# EAGLE board QuDAC (EAGLE 6.6.0), part 1 of 2
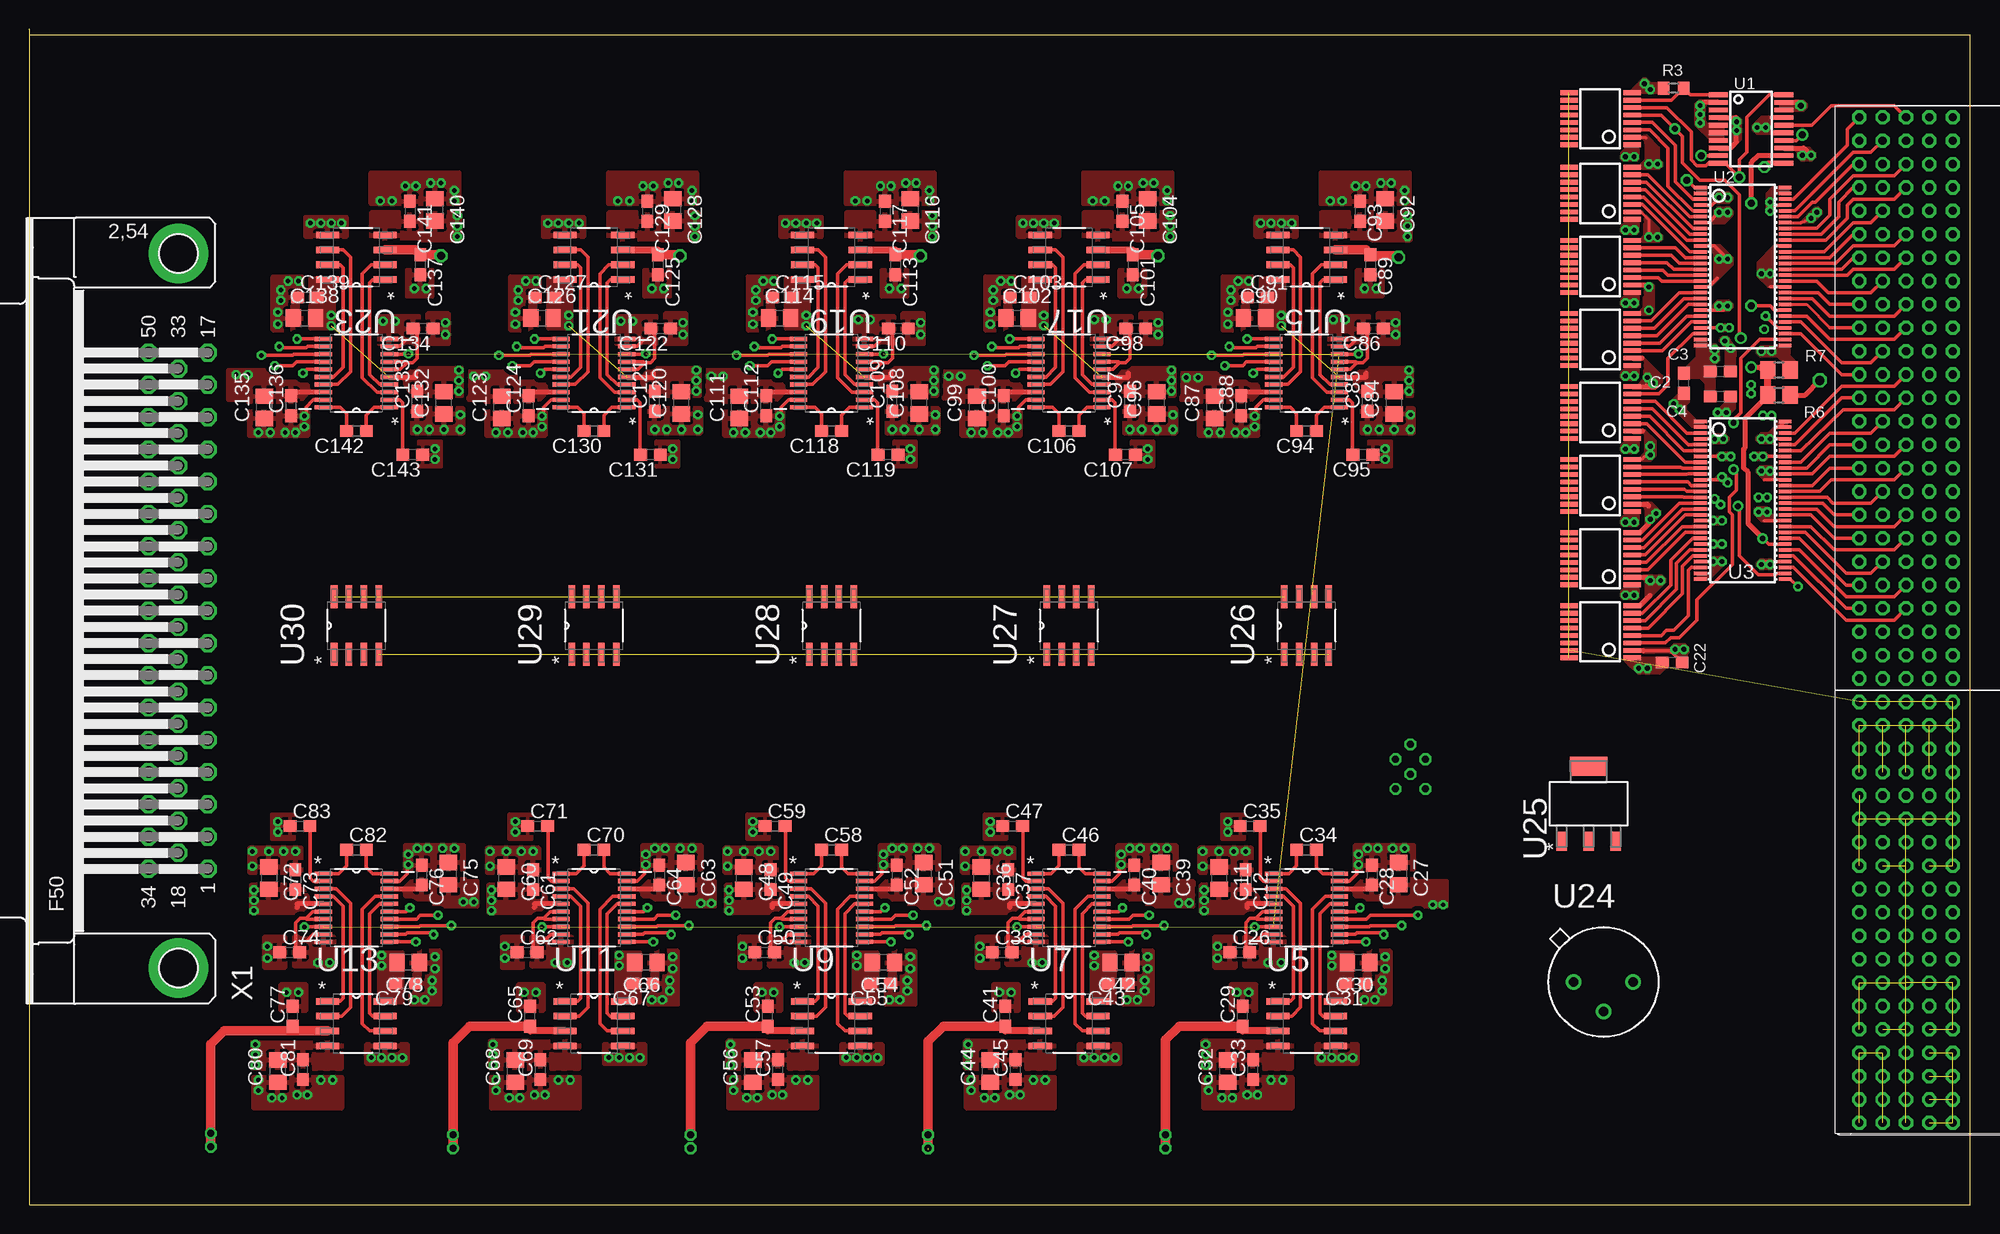
[diagram p14: board, top side]
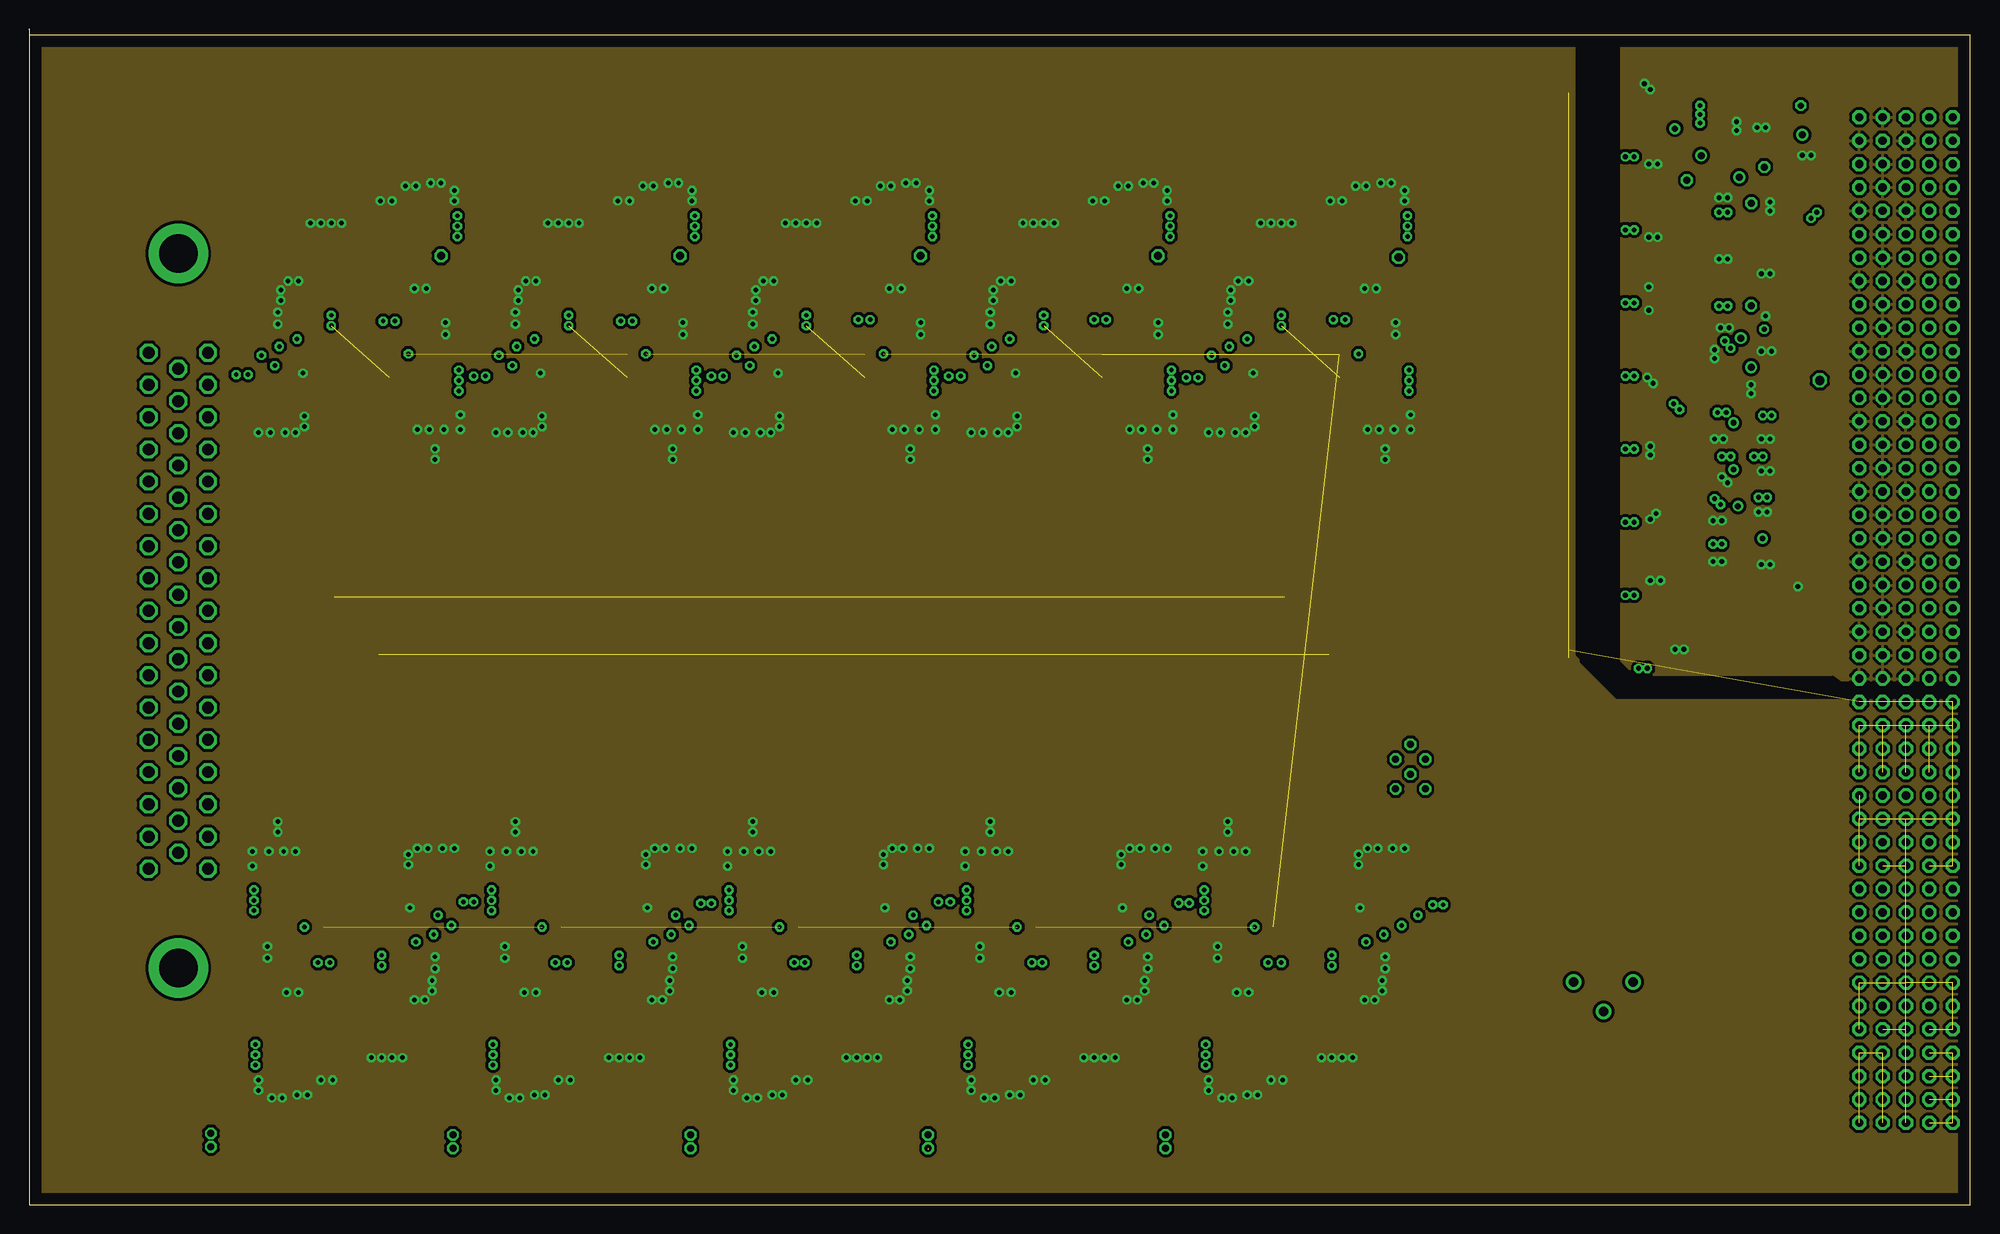
[diagram p15: board, inner layer Route2]
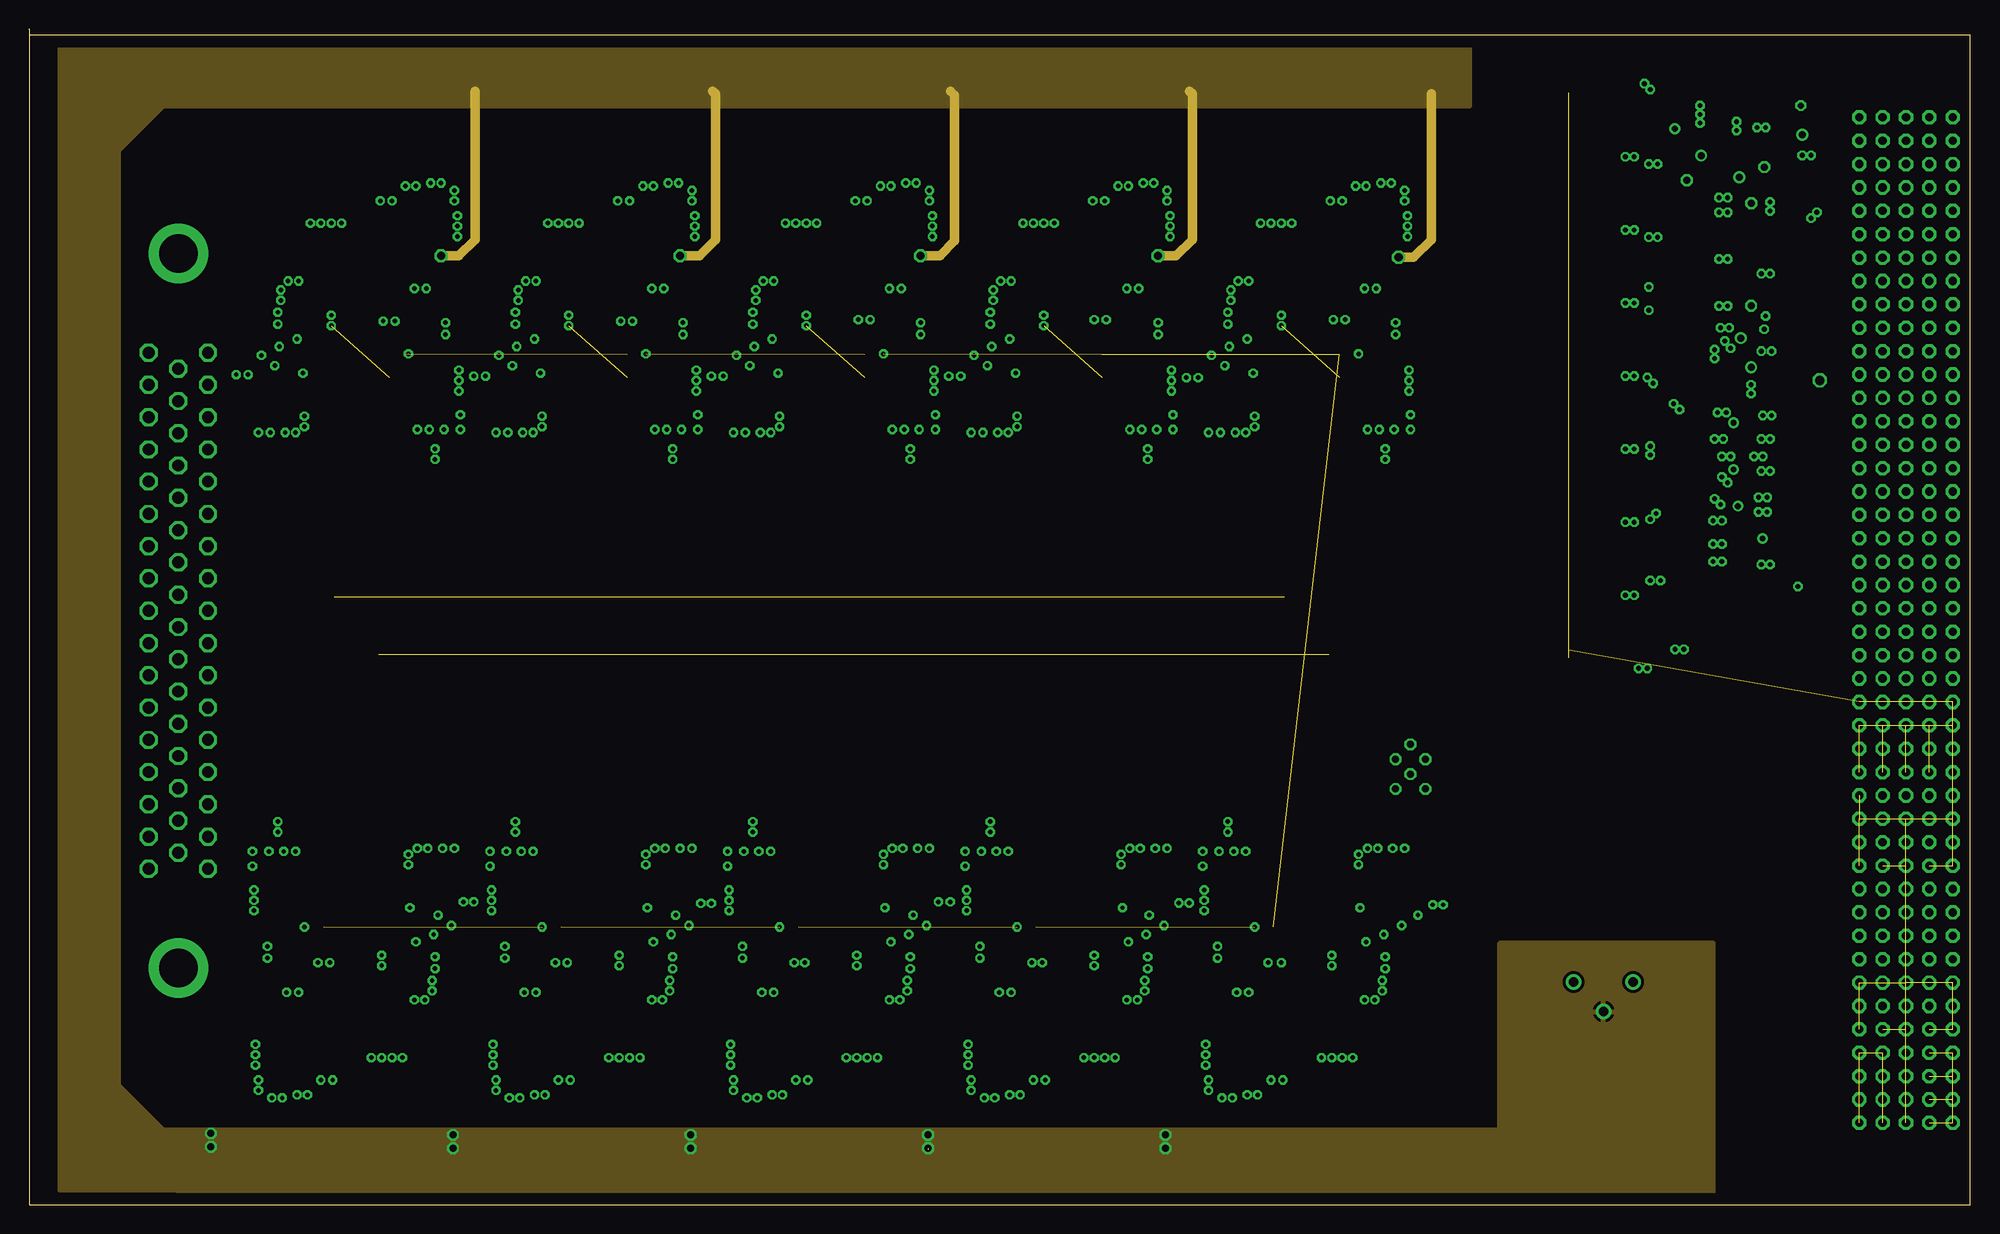
[diagram p16: board, inner layer Route3]
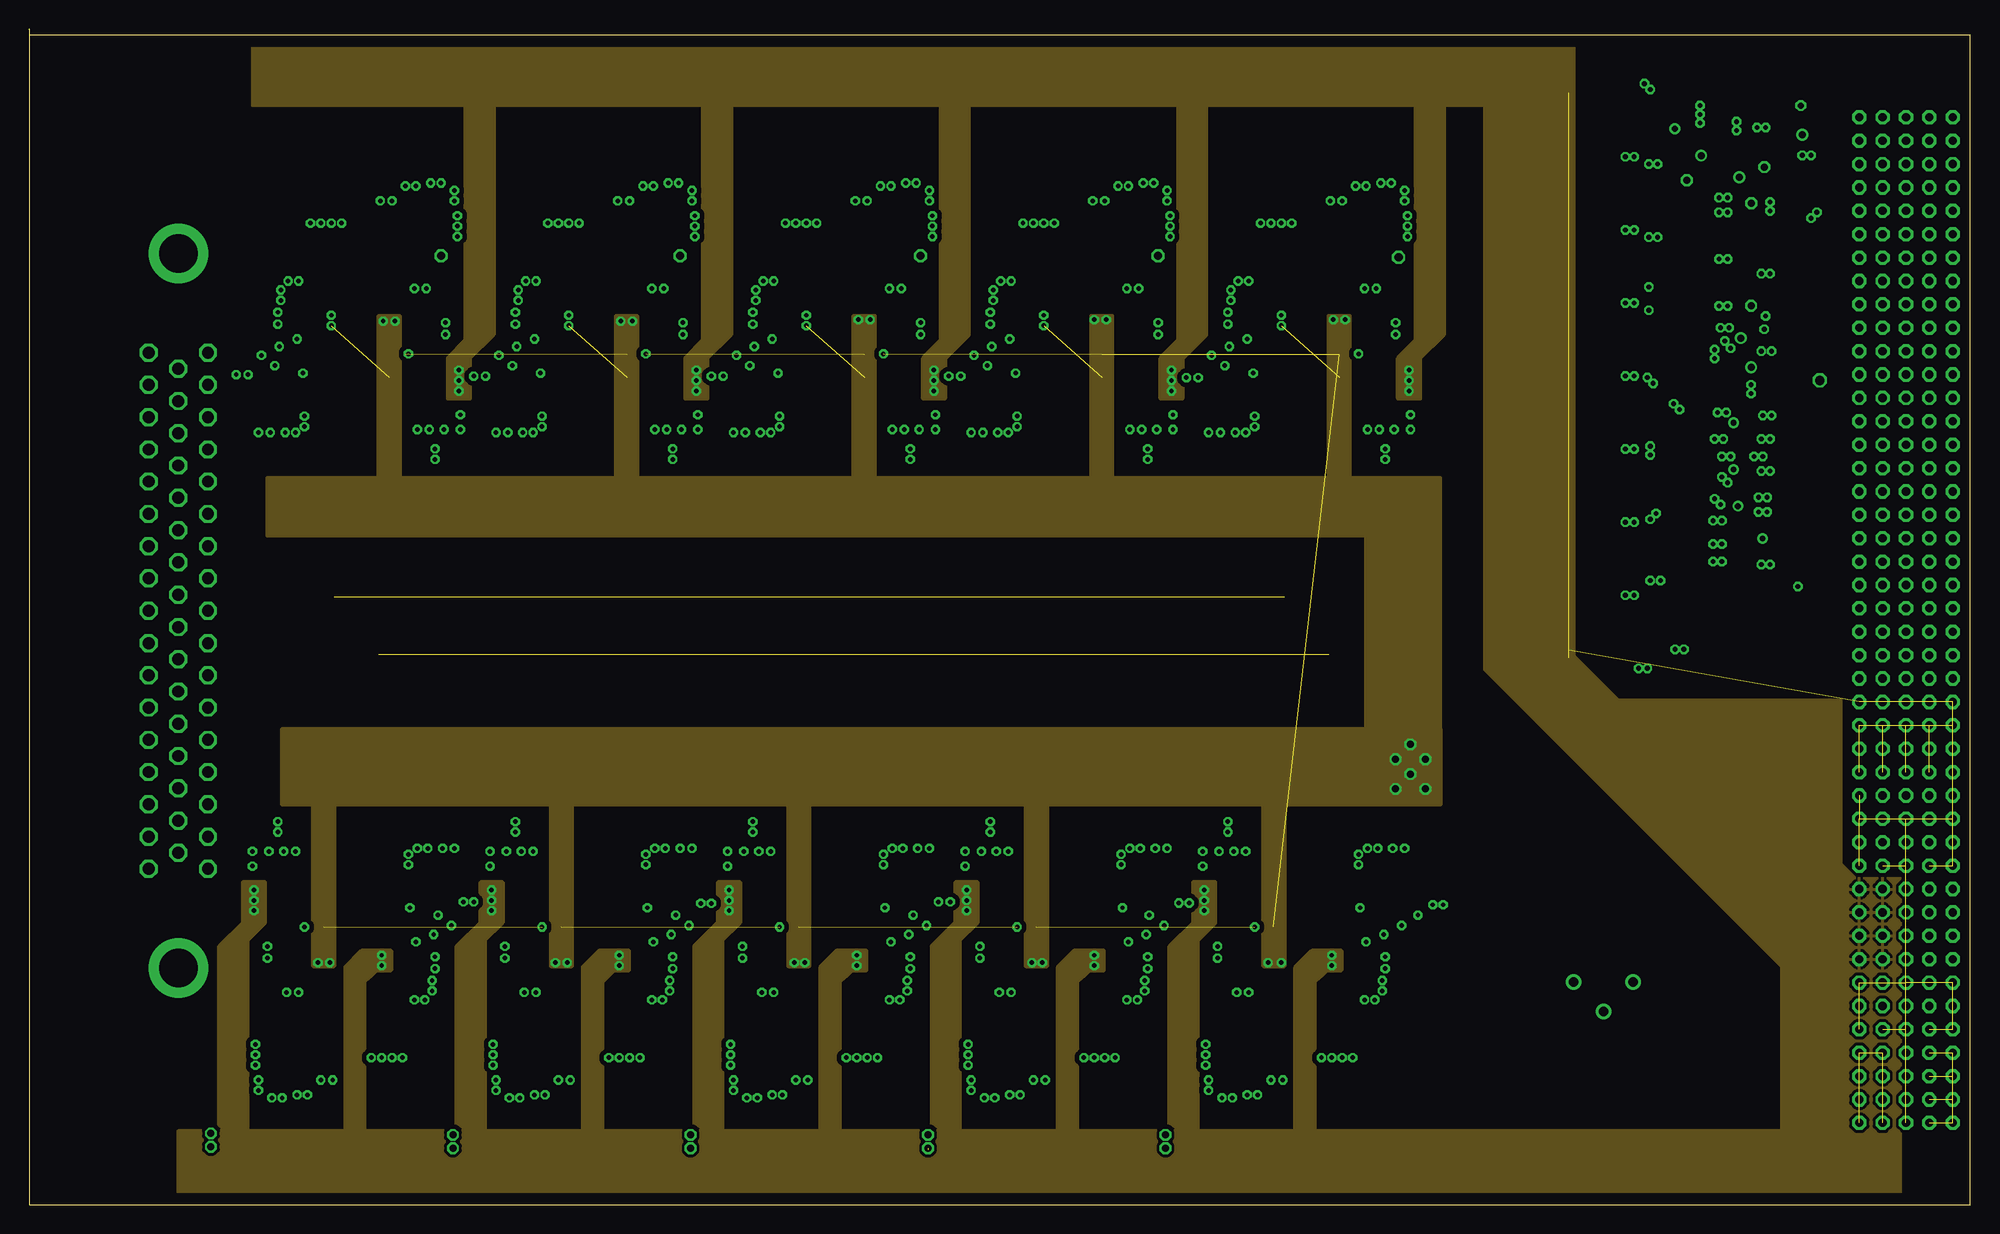
[diagram p17: board, inner layer Route14]
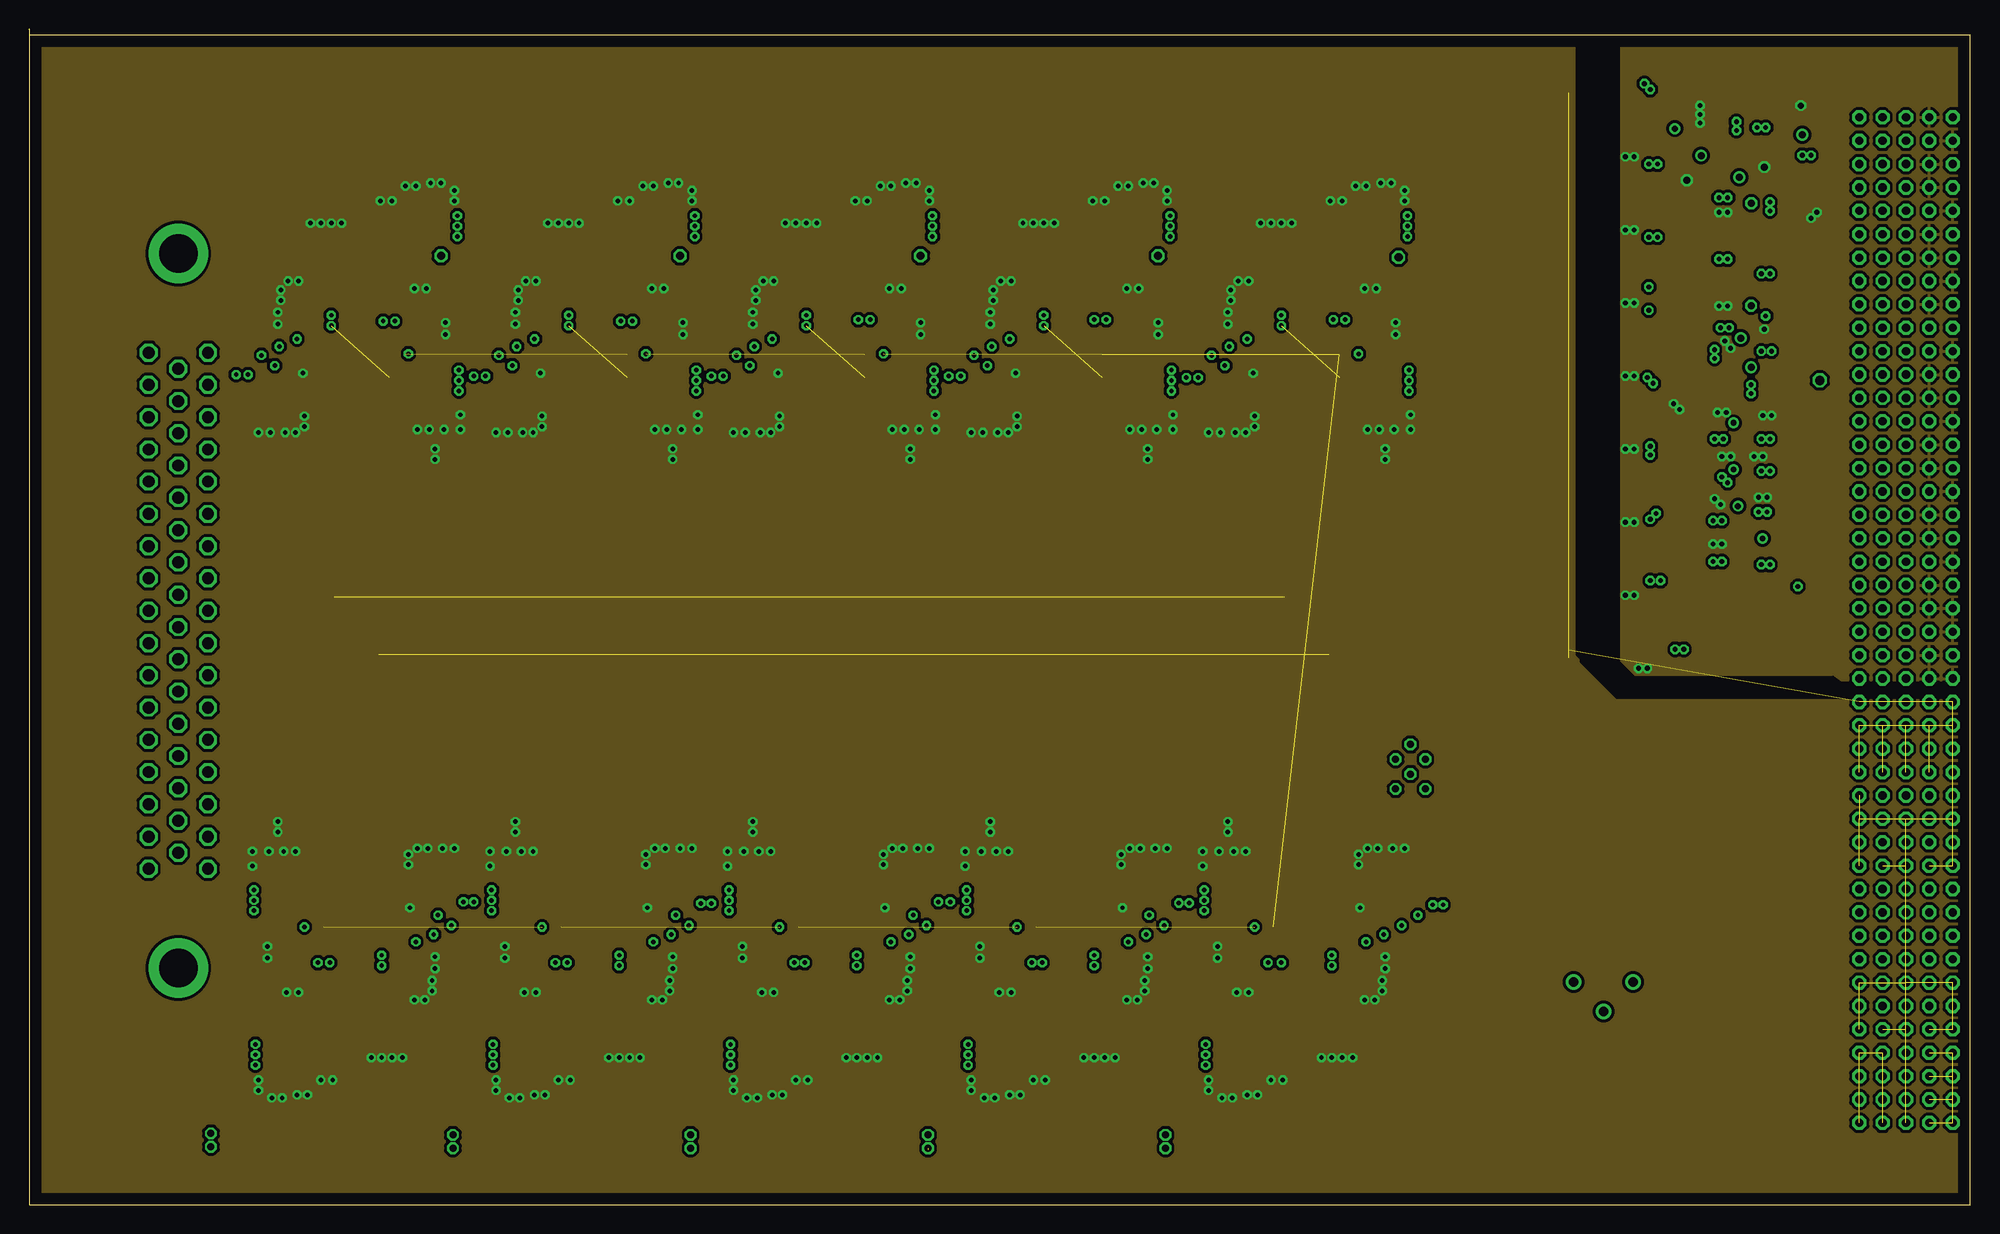
[diagram p18: board, inner layer Route15]
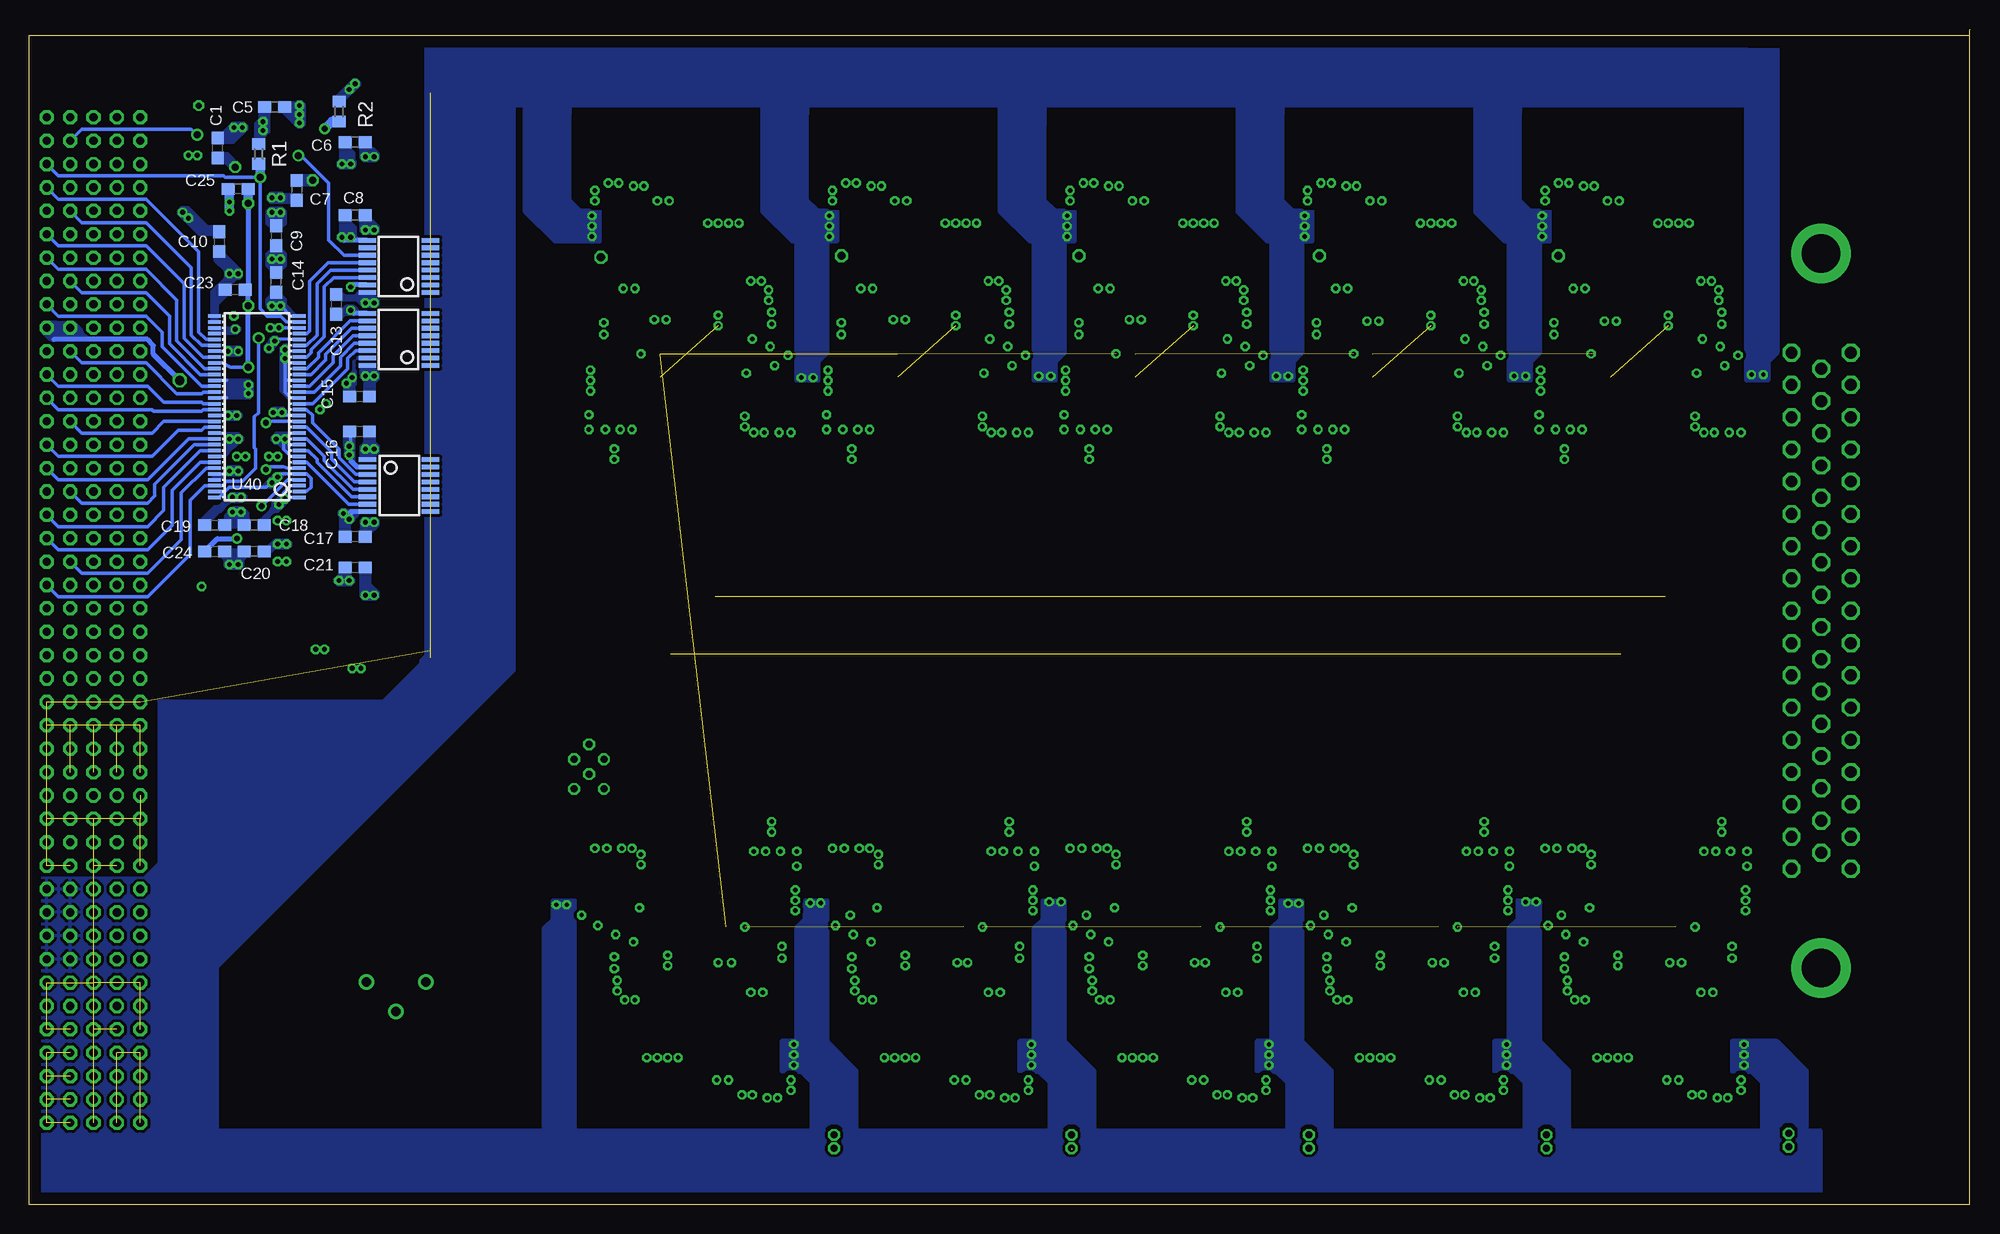
[diagram p19: board, bottom side, seen from below]

Size 166.05 x 100.53 mm. Coordinates in mm from the lower left corner, seen from the top.
Outline: 0.05,0 0.05,100.48 0,100.53
Copper layers (1*2*3*14*15*16): Top 0.035mm / dielectric 1.5mm / Route2 0.035mm / dielectric 0.15mm / Route3 0.035mm / dielectric 0.2mm / Route14 0.035mm / dielectric 0.15mm / Route15 0.035mm / dielectric 0.2mm / Bottom 0.035mm
Design rules "default *": minimum track width 10mil, minimum drill 24mil, track to track 8mil, track to pad 8mil, pad to pad 8mil, via to via 8mil, smd to smd 8mil, copper to edge 40mil, drill to drill 8mil, minimum pad ring 10mil, minimum via ring 8mil, stop-mask expansion 4mil, vias tented up to drill 0mil, thermal gap 10mil
tKeepout: area 132.8,46.4 to 135.9,97; area 132.8,43.5 to 137.3,46.5; area 154.3,43.2 to 166,44.8; area 135.7,43.2 to 154.3,45.2
bKeepout: area 132.8,46.4 to 135.9,95; area 132.8,43.5 to 137.3,46.5; area 154.3,43.2 to 166,44.8

## Footprints (pad centres in the part's own frame; a part is rotated, then mirrored left to right if it is on the bottom)
C0603 = smd 1.1 x 1: 1 -0.85,0; 2 0.85,0
C0805 = smd 1.3 x 1.5: 1 -0.95,0; 2 0.95,0
QSOP-16 = smd 0.4 x 1.5: 1 -2.223,-2.7; 2 -1.587,-2.7; 3 -0.953,-2.7; 4 -0.318,-2.7; 5 0.318,-2.7; 6 0.953,-2.7; 7 1.587,-2.7; 8 2.223,-2.7; 9 2.223,2.7; 10 1.587,2.7; 11 0.953,2.7; 12 0.318,2.7; 13 -0.318,2.7; 14 -0.953,2.7; 15 -1.587,2.7; 16 -2.223,2.7
EUROCARD-CPCI-B19+1B25-NOFRONTDIM = drill 0.7 pad 1.016 octagon: A1 78.5,43; A2 78.5,41; A3 78.5,39; A4 78.5,37; A5 78.5,35; A6 78.5,33; A7 78.5,31; A8 78.5,29; A9 78.5,27; A10 78.5,25; A11 78.5,23; A12 78.5,21; A13 78.5,19; A14 78.5,17; A15 78.5,15; A16 78.5,13; A17 78.5,11; A18 78.5,9; A19 78.5,7; A20 78.5,5; A21 78.5,3; A22 78.5,1; A23 78.5,-1; A24 78.5,-3; A25 78.5,-5; A26 78.5,-7; A27 78.5,-9; A28 78.5,-11; A29 78.5,-13; A30 78.5,-15; A31 78.5,-17; A32 78.5,-19; A33 78.5,-21; A34 78.5,-23; A35 78.5,-25; A36 78.5,-27; A37 78.5,-29; A38 78.5,-31; A39 78.5,-33; A40 78.5,-35; A41 78.5,-37; A42 78.5,-39; A43 78.5,-41; A44 78.5,-43; B1 76.5,43; B2 76.5,41; B3 76.5,39; B4 76.5,37; B5 76.5,35; B6 76.5,33; B7 76.5,31; B8 76.5,29; B9 76.5,27; B10 76.5,25; B11 76.5,23; B12 76.5,21; B13 76.5,19; B14 76.5,17; B15 76.5,15; B16 76.5,13; B17 76.5,11; B18 76.5,9; B19 76.5,7; B20 76.5,5; B21 76.5,3; B22 76.5,1; B23 76.5,-1; B24 76.5,-3; B25 76.5,-5; B26 76.5,-7; B27 76.5,-9; B28 76.5,-11; B29 76.5,-13; B30 76.5,-15; B31 76.5,-17; B32 76.5,-19; B33 76.5,-21; B34 76.5,-23; B35 76.5,-25; B36 76.5,-27; B37 76.5,-29; B38 76.5,-31; B39 76.5,-33; B40 76.5,-35; B41 76.5,-37; B42 76.5,-39; B43 76.5,-41; B44 76.5,-43; C1 74.5,43; C2 74.5,41; C3 74.5,39; C4 74.5,37; C5 74.5,35; C6 74.5,33; C7 74.5,31; C8 74.5,29; C9 74.5,27; C10 74.5,25; C11 74.5,23; C12 74.5,21; C13 74.5,19; C14 74.5,17; C15 74.5,15; C16 74.5,13; C17 74.5,11; C18 74.5,9; C19 74.5,7; C20 74.5,5; C21 74.5,3; C22 74.5,1; C23 74.5,-1; C24 74.5,-3; C25 74.5,-5; C26 74.5,-7; C27 74.5,-9; C28 74.5,-11; C29 74.5,-13; C30 74.5,-15; C31 74.5,-17; C32 74.5,-19; C33 74.5,-21; C34 74.5,-23; C35 74.5,-25; C36 74.5,-27; C37 74.5,-29; C38 74.5,-31; C39 74.5,-33; C40 74.5,-35; C41 74.5,-37; C42 74.5,-39; C43 74.5,-41; C44 74.5,-43; D1 72.5,43; D2 72.5,41; D3 72.5,39; D4 72.5,37; D5 72.5,35; D6 72.5,33; D7 72.5,31; D8 72.5,29; D9 72.5,27; D10 72.5,25; D11 72.5,23; D12 72.5,21; D13 72.5,19; D14 72.5,17; D15 72.5,15; D16 72.5,13; D17 72.5,11; D18 72.5,9; D19 72.5,7; D20 72.5,5; D21 72.5,3; D22 72.5,1; D23 72.5,-1; D24 72.5,-3; D25 72.5,-5; D26 72.5,-7; D27 72.5,-9; D28 72.5,-11; D29 72.5,-13; D30 72.5,-15; D31 72.5,-17; D32 72.5,-19; D33 72.5,-21; D34 72.5,-23; D35 72.5,-25; D36 72.5,-27; D37 72.5,-29; D38 72.5,-31; D39 72.5,-33; D40 72.5,-35; D41 72.5,-37; D42 72.5,-39; D43 72.5,-41; D44 72.5,-43; E1 70.5,43; E2 70.5,41; E3 70.5,39; E4 70.5,37; E5 70.5,35; E6 70.5,33; E7 70.5,31; E8 70.5,29; E9 70.5,27; E10 70.5,25; E11 70.5,23; E12 70.5,21; E13 70.5,19; E14 70.5,17; E15 70.5,15; E16 70.5,13; E17 70.5,11; E18 70.5,9; E19 70.5,7; E20 70.5,5; E21 70.5,3; E22 70.5,1; E23 70.5,-1; E24 70.5,-3; E25 70.5,-5; E26 70.5,-7; E27 70.5,-9; E28 70.5,-11; E29 70.5,-13; E30 70.5,-15; E31 70.5,-17; E32 70.5,-19; E33 70.5,-21; E34 70.5,-23; E35 70.5,-25; E36 70.5,-27; E37 70.5,-29; E38 70.5,-31; E39 70.5,-33; E40 70.5,-35; E41 70.5,-37; E42 70.5,-39; E43 70.5,-41; E44 70.5,-43
R0603 = smd 1 x 1.1: 1 -0.85,0; 2 0.85,0
R0805 = smd 1.3 x 1.5: 1 -0.95,0; 2 0.95,0
TSSOP-20 = smd 0.4 x 1.6: 1 -2.925,-2.8; 2 -2.275,-2.8; 3 -1.625,-2.8; 4 -0.975,-2.8; 5 -0.325,-2.8; 6 0.325,-2.8; 7 0.975,-2.8; 8 1.625,-2.8; 9 2.275,-2.8; 10 2.925,-2.8; 11 2.925,2.8; 12 2.275,2.8; 13 1.625,2.8; 14 0.975,2.8; 15 0.325,2.8; 16 -0.325,2.8; 17 -0.975,2.8; 18 -1.625,2.8; 19 -2.275,2.8; 20 -2.925,2.8
TSSOP-56 = smd 0.3 x 1.1: 1 -7,0.4; 2 -6.5,0.4; 3 -6,0.4; 4 -5.5,0.4; 5 -5,0.4; 6 -4.5,0.4; 7 -4,0.4; 8 -3.5,0.4; 9 -3,0.4; 10 -2.5,0.4; 11 -2,0.4; 12 -1.5,0.4; 13 -1,0.4; 14 -0.5,0.4; 15 0,0.4; 16 0.5,0.4; 17 1,0.4; 18 1.5,0.4; 19 2,0.4; 20 2.5,0.4; 21 3,0.4; 22 3.5,0.4; 23 4,0.4; 24 4.5,0.4; 25 5,0.4; 26 5.5,0.4; 27 6,0.4; 28 6.5,0.4; 29 6.5,7.66; 30 6,7.66; 31 5.5,7.66; 32 5,7.66; 33 4.5,7.66; 34 4,7.66; 35 3.5,7.66; 36 3,7.66; 37 2.5,7.66; 38 2,7.66; 39 1.5,7.66; 40 1,7.66; 41 0.5,7.66; 42 0,7.66; 43 -0.5,7.66; 44 -1,7.66; 45 -1.5,7.66; 46 -2,7.66; 47 -2.5,7.66; 48 -3,7.66; 49 -3.5,7.66; 50 -4,7.66; 51 -4.5,7.66; 52 -5,7.66; 53 -5.5,7.66; 54 -6,7.66; 55 -6.5,7.66; 56 -7,7.66
SOP65P640X120-20N = smd 1.473 x 0.356: 1 -2.819,2.921; 2 -2.819,2.286; 3 -2.819,1.626; 4 -2.819,0.965; 5 -2.819,0.33; 6 -2.819,-0.33; 7 -2.819,-0.965; 8 -2.819,-1.626; 9 -2.819,-2.286; 10 -2.819,-2.921; 11 2.819,-2.921; 12 2.819,-2.286; 13 2.819,-1.626; 14 2.819,-0.965; 15 2.819,-0.33; 16 2.819,0.33; 17 2.819,0.965; 18 2.819,1.626; 19 2.819,2.286; 20 2.819,2.921
SOIC127P600X175-8N = smd 1.981 x 0.559: 1 -2.464,1.905; 2 -2.464,0.635; 3 -2.464,-0.635; 4 -2.464,-1.905; 5 2.464,-1.905; 6 2.464,-0.635; 7 2.464,0.635; 8 2.464,1.905
TO254P939X470-3P = drill 0.813: 1 -5.08,0; 2 -2.54,-2.54; 3 0,0
SOT230P700X180-4N = smd 1.626 x 0.889: 1 -3.2,2.311; 2 -3.2,0; 3 -3.2,-2.311 | smd 1.626 x 3.175: 4 3.2,0
TSSOP-64 = smd 0.3 x 1.1: 1 -7.5,0.4; 2 -7,0.4; 3 -6.5,0.4; 4 -6,0.4; 5 -5.5,0.4; 6 -5,0.4; 7 -4.5,0.4; 8 -4,0.4; 9 -3.5,0.4; 10 -3,0.4; 11 -2.5,0.4; 12 -2,0.4; 13 -1.5,0.4; 14 -1,0.4; 15 -0.5,0.4; 16 0,0.4; 17 0.5,0.4; 18 1,0.4; 19 1.5,0.4; 20 2,0.4; 21 2.5,0.4; 22 3,0.4; 23 3.5,0.4; 24 4,0.4; 25 4.5,0.4; 26 5,0.4; 27 5.5,0.4; 28 6,0.4; 29 6.5,0.4; 30 7,0.4; 31 7.5,0.4; 32 8,0.4; 33 8,7.66; 34 7.5,7.66; 35 7,7.66; 36 6.5,7.66; 37 6,7.66; 38 5.5,7.66; 39 5,7.66; 40 4.5,7.66; 41 4,7.66; 42 3.5,7.66; 43 3,7.66; 44 2.5,7.66; 45 2,7.66; 46 1.5,7.66; 47 1,7.66; 48 0.5,7.66; 49 0,7.66; 50 -0.5,7.66; 51 -1,7.66; 52 -1.5,7.66; 53 -2,7.66; 54 -2.5,7.66; 55 -3,7.66; 56 -3.5,7.66; 57 -4,7.66; 58 -4.5,7.66; 59 -5,7.66; 60 -5.5,7.66; 61 -6,7.66; 62 -6.5,7.66; 63 -7,7.66; 64 -7.5,7.66
F50HP = drill 1.016 octagon: 1 -22.073,-2.54; 2 -19.329,-2.54; 3 -16.561,-2.54; 4 -13.792,-2.54; 5 -11.049,-2.54; 6 -8.28,-2.54; 7 -5.512,-2.54; 8 -2.769,-2.54; 9 0,-2.54; 10 2.769,-2.54; 11 5.512,-2.54; 12 8.28,-2.54; 13 11.049,-2.54; 14 13.792,-2.54; 15 16.561,-2.54; 16 19.329,-2.54; 17 22.073,-2.54; 18 -20.701,0; 19 -17.958,0; 20 -15.189,0; 21 -12.421,0; 22 -9.677,0; 23 -6.909,0; 24 -4.14,0; 25 -1.397,0; 26 1.372,0; 27 4.14,0; 28 6.883,0; 29 9.652,0; 30 12.421,0; 31 15.189,0; 32 17.932,0; 33 20.701,0; 34 -22.073,2.54; 35 -19.329,2.54; 36 -16.561,2.54; 37 -13.792,2.54; 38 -11.049,2.54; 39 -8.28,2.54; 40 -5.512,2.54; 41 -2.769,2.54; 42 0,2.54; 43 2.769,2.54; 44 5.512,2.54; 45 8.28,2.54; 46 11.049,2.54; 47 13.792,2.54; 48 16.561,2.54; 49 19.329,2.54; 50 22.073,2.54 | drill 3.302 pad 5.08: G1 -30.556,0; G2 30.556,0

## Placement (x,y rotation side)
C1  [C0603]  149.92,90.38 90 bottom
C2  [C0603]  141.55,70.25 90 top
C3  [C0603]  144.67,71.25 180 top
C4  [C0603]  144.67,69.12 180 top
C5  [C0603]  145.05,93.88 180 bottom
C6  [C0603]  138.17,90.88 180 bottom
C7  [C0603]  143.17,86.75 270 bottom
C8  [C0603]  138.17,84.62 180 bottom
C9  [C0603]  144.92,82.88 270 bottom
C10  [C0603]  149.8,82.38 270 bottom
C11  10uF  [C0805]  101.78,27.94 270 top
C12  0.1uF  [C0603]  104.06,27.81 270 top
C13  [C0603]  139.8,77 270 bottom
C14  [C0603]  144.92,78.88 90 bottom
C15  [C0603]  137.8,69.12 180 bottom
C16  [C0603]  137.8,66.12 180 bottom
C17  [C0603]  138.17,57.12 180 bottom
C18  [C0603]  146.8,58.12 180 bottom
C19  [C0603]  150.17,58.12 0 bottom
C20  [C0603]  146.8,55.88 180 bottom
C21  [C0603]  138.17,54.5 180 bottom
C22  [C0603]  140.55,46.38 0 top
C23  .1uF  [C0603]  148.42,78.25 180 bottom
C24  .1uF  [C0603]  150.17,55.88 0 bottom
C25  .1uF  [C0603]  148.17,86.88 180 bottom
C26  [C0603]  103.56,21.59 0 top
C27  10uF  [C0805]  117.14,28.32 270 top
C28  0.1uF  [C0603]  114.86,28.19 270 top
C29  0.1uF  [C0603]  103.81,16.13 90 top
C30  10uF  [C0805]  113.72,20.7 180 top
C31  0.1uF  [C0603]  113.46,18.92 180 top
C32  10uF  [C0805]  102.54,11.43 90 top
C33  0.1uF  [C0603]  104.7,11.56 90 top
C34  10pF  [C0603]  109.27,30.35 0 top
C35  50pF  [C0603]  104.44,32.38 0 top
C36  10uF  [C0805]  81.46,27.94 270 top
C37  0.1uF  [C0603]  83.74,27.81 270 top
C38  [C0603]  83.24,21.59 0 top
C39  10uF  [C0805]  96.82,28.32 270 top
C40  0.1uF  [C0603]  94.54,28.19 270 top
C41  0.1uF  [C0603]  83.49,16.13 90 top
C42  10uF  [C0805]  93.4,20.7 180 top
C43  0.1uF  [C0603]  93.14,18.92 180 top
C44  10uF  [C0805]  82.22,11.43 90 top
C45  0.1uF  [C0603]  84.38,11.56 90 top
C46  10pF  [C0603]  88.95,30.35 0 top
C47  50pF  [C0603]  84.12,32.38 0 top
C48  10uF  [C0805]  61.14,27.94 270 top
C49  0.1uF  [C0603]  63.42,27.81 270 top
C50  [C0603]  62.92,21.59 0 top
C51  10uF  [C0805]  76.5,28.32 270 top
C52  0.1uF  [C0603]  74.22,28.19 270 top
C53  0.1uF  [C0603]  63.17,16.13 90 top
C54  10uF  [C0805]  73.08,20.7 180 top
C55  0.1uF  [C0603]  72.82,18.92 180 top
C56  10uF  [C0805]  61.9,11.43 90 top
C57  0.1uF  [C0603]  64.06,11.56 90 top
C58  10pF  [C0603]  68.63,30.35 0 top
C59  50pF  [C0603]  63.8,32.38 0 top
C60  10uF  [C0805]  40.82,27.94 270 top
C61  0.1uF  [C0603]  43.1,27.81 270 top
C62  [C0603]  42.6,21.59 0 top
C63  10uF  [C0805]  56.18,28.32 270 top
C64  0.1uF  [C0603]  53.9,28.19 270 top
C65  0.1uF  [C0603]  42.85,16.13 90 top
C66  10uF  [C0805]  52.76,20.7 180 top
C67  0.1uF  [C0603]  52.5,18.92 180 top
C68  10uF  [C0805]  41.58,11.43 90 top
C69  0.1uF  [C0603]  43.74,11.56 90 top
C70  10pF  [C0603]  48.31,30.35 0 top
C71  50pF  [C0603]  43.48,32.38 0 top
C72  10uF  [C0805]  20.5,27.94 270 top
C73  0.1uF  [C0603]  22.78,27.81 270 top
C74  [C0603]  22.28,21.59 0 top
C75  10uF  [C0805]  35.86,28.32 270 top
C76  0.1uF  [C0603]  33.58,28.19 270 top
C77  0.1uF  [C0603]  22.53,16.13 90 top
C78  10uF  [C0805]  32.44,20.7 180 top
C79  0.1uF  [C0603]  32.18,18.92 180 top
C80  10uF  [C0805]  21.26,11.43 90 top
C81  0.1uF  [C0603]  23.42,11.56 90 top
C82  10pF  [C0603]  27.99,30.35 0 top
C83  50pF  [C0603]  23.16,32.38 0 top
C84  10uF  [C0805]  116.76,68.58 90 top
C85  0.1uF  [C0603]  114.48,68.71 90 top
C86  [C0603]  114.99,74.93 180 top
C87  10uF  [C0805]  101.4,68.2 90 top
C88  0.1uF  [C0603]  103.68,68.33 90 top
C89  0.1uF  [C0603]  114.73,80.39 270 top
C90  10uF  [C0805]  104.83,75.82 0 top
C91  0.1uF  [C0603]  105.08,77.6 0 top
C92  10uF  [C0805]  116,85.09 270 top
C93  0.1uF  [C0603]  113.84,84.96 270 top
C94  10pF  [C0603]  109.27,66.17 180 top
C95  50pF  [C0603]  114.1,64.14 180 top
C96  10uF  [C0805]  96.44,68.58 90 top
C97  0.1uF  [C0603]  94.16,68.71 90 top
C98  [C0603]  94.67,74.93 180 top
C99  10uF  [C0805]  81.08,68.2 90 top
C100  0.1uF  [C0603]  83.36,68.33 90 top
C101  0.1uF  [C0603]  94.41,80.39 270 top
C102  10uF  [C0805]  84.51,75.82 0 top
C103  0.1uF  [C0603]  84.76,77.6 0 top
C104  10uF  [C0805]  95.68,85.09 270 top
C105  0.1uF  [C0603]  93.52,84.96 270 top
C106  10pF  [C0603]  88.95,66.17 180 top
C107  50pF  [C0603]  93.78,64.14 180 top
C108  10uF  [C0805]  76.12,68.58 90 top
C109  0.1uF  [C0603]  73.84,68.71 90 top
C110  [C0603]  74.35,74.93 180 top
C111  10uF  [C0805]  60.76,68.2 90 top
C112  0.1uF  [C0603]  63.04,68.33 90 top
C113  0.1uF  [C0603]  74.09,80.39 270 top
C114  10uF  [C0805]  64.19,75.82 0 top
C115  0.1uF  [C0603]  64.44,77.6 0 top
C116  10uF  [C0805]  75.36,85.09 270 top
C117  0.1uF  [C0603]  73.2,84.96 270 top
C118  10pF  [C0603]  68.63,66.17 180 top
C119  50pF  [C0603]  73.46,64.14 180 top
C120  10uF  [C0805]  55.8,68.58 90 top
C121  0.1uF  [C0603]  53.52,68.71 90 top
C122  [C0603]  54.03,74.93 180 top
C123  10uF  [C0805]  40.44,68.2 90 top
C124  0.1uF  [C0603]  42.72,68.33 90 top
C125  0.1uF  [C0603]  53.77,80.39 270 top
C126  10uF  [C0805]  43.87,75.82 0 top
C127  0.1uF  [C0603]  44.12,77.6 0 top
C128  10uF  [C0805]  55.04,85.09 270 top
C129  0.1uF  [C0603]  52.88,84.96 270 top
C130  10pF  [C0603]  48.31,66.17 180 top
C131  50pF  [C0603]  53.14,64.14 180 top
C132  10uF  [C0805]  35.48,68.58 90 top
C133  0.1uF  [C0603]  33.2,68.71 90 top
C134  [C0603]  33.71,74.93 180 top
C135  10uF  [C0805]  20.12,68.2 90 top
C136  0.1uF  [C0603]  22.4,68.33 90 top
C137  0.1uF  [C0603]  33.45,80.39 270 top
C138  10uF  [C0805]  23.55,75.82 0 top
C139  0.1uF  [C0603]  23.8,77.6 0 top
C140  10uF  [C0805]  34.72,85.09 270 top
C141  0.1uF  [C0603]  32.56,84.96 270 top
C142  10pF  [C0603]  27.99,66.17 180 top
C143  50pF  [C0603]  32.82,64.14 180 top
ISO1  SI-SI8655  [QSOP-16]  134.42,92.88 90 top
ISO2  SI-SI8655  [QSOP-16]  134.42,86.5 90 top
ISO3  SI-SI8655  [QSOP-16]  134.42,80.25 90 top
ISO4  SI-SI8655  [QSOP-16]  134.42,74 90 top
ISO5  SI-SI8655  [QSOP-16]  134.42,67.75 90 top
ISO6  SI-SI8655  [QSOP-16]  134.42,61.5 90 top
ISO7  SI-SI8655  [QSOP-16]  134.42,55.25 90 top
ISO8  SI-SI8655  [QSOP-16]  134.42,49 90 top
ISO9  SI-SI8655  [QSOP-16]  134.42,74 90 bottom
ISO10  SI-SI8655  [QSOP-16]  134.42,80.25 90 bottom
ISO11  SI-SI8655  [QSOP-16]  134.42,61.5 270 bottom
J1  EUROCARD-CPCI-220EUROCARD-B19+AB25-NOFRONTDIM  [EUROCARD-CPCI-B19+1B25-NOFRONTDIM]  86.05,50 0 top
R1  [R0603]  146.42,89.88 270 bottom
R2  [R0603]  139.55,93.5 270 bottom
R3  10k  [R0603]  140.67,95.5 0 top
R6  1k  [R0805]  149.67,69.25 0 top
R7  2k  [R0805]  149.67,71.38 180 top
U1  TI-SN74GTLP1395  [TSSOP-20]  147.3,92 270 top
U2  TI-SN74GTLPH16912  [TSSOP-56]  142.55,80 270 top
U3  TI-SN74GTLPH16912  [TSSOP-56]  142.55,60 270 top
U4  AD5791BRUZ  [SOP65P640X120-20N]  109.27,25.4 0 top
U5  AD8676ARZ  [SOIC127P600X175-8N]  109.27,15.49 0 top
U6  AD5791BRUZ  [SOP65P640X120-20N]  88.95,25.4 0 top
U7  AD8676ARZ  [SOIC127P600X175-8N]  88.95,15.49 0 top
U8  AD5791BRUZ  [SOP65P640X120-20N]  68.63,25.4 0 top
U9  AD8676ARZ  [SOIC127P600X175-8N]  68.63,15.49 0 top
U10  AD5791BRUZ  [SOP65P640X120-20N]  48.31,25.4 0 top
U11  AD8676ARZ  [SOIC127P600X175-8N]  48.31,15.49 0 top
U12  AD5791BRUZ  [SOP65P640X120-20N]  27.99,25.4 0 top
U13  AD8676ARZ  [SOIC127P600X175-8N]  27.99,15.49 0 top
U14  AD5791BRUZ  [SOP65P640X120-20N]  109.27,71.12 180 top
U15  AD8676ARZ  [SOIC127P600X175-8N]  109.27,81.03 180 top
U16  AD5791BRUZ  [SOP65P640X120-20N]  88.95,71.12 180 top
U17  AD8676ARZ  [SOIC127P600X175-8N]  88.95,81.03 180 top
U18  AD5791BRUZ  [SOP65P640X120-20N]  68.63,71.12 180 top
U19  AD8676ARZ  [SOIC127P600X175-8N]  68.63,81.03 180 top
U20  AD5791BRUZ  [SOP65P640X120-20N]  48.31,71.12 180 top
U21  AD8676ARZ  [SOIC127P600X175-8N]  48.31,81.03 180 top
U22  AD5791BRUZ  [SOP65P640X120-20N]  27.99,71.12 180 top
U23  AD8676ARZ  [SOIC127P600X175-8N]  27.99,81.03 180 top
U24  AD581KH  [TO254P939X470-3P]  137.21,19.05 0 top
U25  ADP3339-3.3  [SOT230P700X180-4N]  133.4,34.29 90 top
U26  AD8620BRZ  [SOIC127P600X175-8N]  109.27,49.53 90 top
U27  AD8620BRZ  [SOIC127P600X175-8N]  88.95,49.53 90 top
U28  AD8620BRZ  [SOIC127P600X175-8N]  68.63,49.53 90 top
U29  AD8620BRZ  [SOIC127P600X175-8N]  48.31,49.53 90 top
U30  AD8620BRZ  [SOIC127P600X175-8N]  27.99,49.53 90 top
U40  TI-SN74GTLPH1655  [TSSOP-64]  142.55,68 90 bottom
X1  [F50HP]  12.75,50.8 90 top

## Tracks (layer width: path | path; a pad name or v marks a point on that pad's centre or on a via)
0B0
  Top 0.305: U2.3 142.3,86 140.8,87.5 140.8,90.62 138.87,92.56 ISO1.4
0B1
  Top 0.305: U2.5 142.3,85 140.17,87.12 140.17,90.38 138.63,91.92 ISO1.3
0B2
  Top 0.305: U2.6 142.05,84.5 138.46,88.09 ISO2.7
0B3
  Top 0.305: U2.8 142.3,83.5 138.35,87.45 ISO2.6
0B4
  Top 0.305: U2.9 142.05,83 138.23,86.82 ISO2.5
0B5
  Top 0.305: U2.10 141.8,82.5 138.12,86.18 ISO2.4
0B6
  Top 0.305: U2.12 142.05,81.5 138,85.55 ISO2.3
0B7
  Top 0.305: U2.13 141.67,81 140.84,81.84 ISO3.7
0B8
  Top 0.305: U2.14 141.17,80.5 140.47,81.2 ISO3.6
0B9
  Top 0.305: U2.15 140.67,80 140.11,80.57 ISO3.5
0B10
  Top 0.305: U2.16 140.17,79.5 139.73,79.93 ISO3.4
0B11
  Top 0.305: U2.17 139.67,79 139.35,79.3 ISO3.3
0B12
  Top 0.305: ISO4.7 138.76,75.59 141.17,78 U2.19
0B13
  Top 0.305: ISO4.6 139,74.95 141.55,77.5 U2.20
0B14
  Top 0.305: ISO4.5 139.24,74.32 141.92,77 U2.21
0B15
  Top 0.305: ISO4.4 139.48,73.68 141.8,76 U2.23
0B16
  Top 0.305: ISO4.3 139.72,73.05 142.17,75.5 U2.24
0B17
  Top 0.305: U2.26 142.3,74.5 140.17,72.38 140.17,70.12 139.39,69.34 ISO5.7
1B0
  Top 0.305: U3.3 141.8,66 139.1,68.7 ISO5.6
1B1
  Top 0.305: U3.5 141.92,65 138.86,68.07 ISO5.5
1B2
  Top 0.305: U3.6 141.55,64.5 138.62,67.43 ISO5.4
1B3
  Top 0.305: U3.8 141.67,63.5 138.38,66.8 ISO5.3
1B4
  Top 0.305: ISO6.7 141.26,63.09 141.42,63 U3.9
1B5
  Top 0.305: ISO6.6 141.75,62.45 141.92,62.5 U3.10
1B6
  Top 0.305: ISO6.5 141.87,61.82 142.17,61.5 U3.12
1B7
  Top 0.305: ISO6.4 141.61,61.18 141.8,61 U3.13
1B8
  Top 0.305: ISO6.3 141.47,60.55 141.55,60.5 U3.14
1B9
  Top 0.305: U3.15 141.17,60 138.01,56.84 ISO7.7
1B10
  Top 0.305: U3.16 141.42,59.5 138.13,56.2 ISO7.6
1B11
  Top 0.305: U3.17 141.67,59 138.24,55.57 ISO7.5
1B12
  Top 0.305: U3.19 141.42,58 138.36,54.93 ISO7.4
1B13
  Top 0.305: U3.20 141.67,57.5 138.47,54.3 ISO7.3
1B14
  Top 0.305: U3.21 142.3,57 140.42,55.12 140.42,53 138.01,50.59 ISO8.7
1B15
  Top 0.305: ISO8.6 138.25,49.95 140.92,52.62 140.92,54.88 142.05,56 U3.23
1B16
  Top 0.305: ISO8.5 138.49,49.32 141.42,52.25 141.42,54.62 142.3,55.5 U3.24
1B17
  Top 0.305: ISO8.4 139.61,48.68 140.05,49.12 140.67,49.12 141.92,50.38 141.92,54.25 142.17,54.5 U3.26
2B0-1  (via drill 0.5)
  Top 0.305: v145.8,62.88 146.05,62.62 146.05,61.12 145.42,60.5 145.42,59.25 145.67,59 145.67,54.75 142.67,51.75 142.67,50 141.17,48.5 140.42,48.5 139.97,48.05 ISO8.3
  Bottom 0.305: U40.6 143.92,63 144.3,63.12 145.55,63.12 v145.8,62.88
2B0-2
  Bottom 0.305: ISO11.7 138.71,59.91 142.3,63.5 U40.7
2B0-3
  Bottom 0.305: U40.9 142.17,64.5 141.42,63.75 141.42,63.5 138.47,60.55 ISO11.6
2B0-4
  Bottom 0.305: ISO11.5 138.36,61.18 140.8,63.62 140.8,64 142.3,65.5 U40.11
2B0-5
  Bottom 0.305: ISO11.4 138.24,61.82 140.17,63.75 140.17,64.38 142.3,66.5 U40.13
2B0-7
  Bottom 0.305: U40.16 142.3,68 141.8,67.5 141.8,66.88 139.55,64.62 139.55,63.88 138.13,62.45 ISO11.3
2B1-0
  Bottom 0.305: ISO9.14 138.13,73.05 138.8,72.38 138.8,71.5 141.8,68.5 U40.17
2B1-1
  Bottom 0.305: ISO9.13 138.24,73.68 139.42,72.5 139.42,71.75 141.67,69.5 U40.19
2B1-2
  Bottom 0.305: ISO9.12 138.36,74.32 140.05,72.62 140.05,72 142.05,70 U40.20
2B1-3
  Bottom 0.305: U40.22 141.92,71 140.67,72.25 140.67,72.75 138.47,74.95 ISO9.11
2B1-4
  Bottom 0.305: U40.23 142.3,71.5 141.3,72.5 141.3,72.88 138.59,75.59 ISO9.10
2B1-5
  Bottom 0.305: U40.25 142.3,72.5 141.92,72.88 141.92,73.12 140.8,74.25 140.8,78.5 140,79.3 ISO10.14
2B1-6
  Bottom 0.305: U40.27 142.3,73.5 141.42,74.38 141.42,78.75 140.24,79.93 ISO10.13
2B1-7
  Bottom 0.305: U40.29 142.3,74.5 142.05,74.75 142.05,79 140.48,80.57 ISO10.12
+5V  (14 unrouted)
+RAIL  (7 unrouted)
+VPWR  (via drill 0.38)  (5 unrouted)
  Top 0.406: U4.5 104.19,25.73 104.19,25.4 | U6.5 83.87,25.73 83.87,25.4 | U8.5 63.55,25.73 63.55,25.4 | U10.5 43.23,25.73 43.23,25.4 | U12.5 22.91,25.73 22.91,25.4 | U14.5 114.35,70.79 114.35,71.12 | U16.5 94.03,70.79 94.03,71.12 | U18.5 73.71,70.79 73.71,71.12 | U20.5 53.39,70.79 53.39,71.12 | U22.5 33.07,70.79 33.07,71.12
  other vias: 111.43,21.34 111.43,20.45 100.51,26.92 100.51,26.04 100.51,25.15 91.11,21.34 91.11,20.45 80.19,26.92 80.19,26.04 80.19,25.15 70.79,21.34 70.79,20.45 59.87,26.92 59.87,26.04 59.87,25.15 50.47,21.34 50.47,20.45 39.55,26.92 39.55,26.04 39.55,25.15 30.15,21.34 30.15,20.45 19.23,26.92 19.23,26.04 19.23,25.15 107.11,75.18 107.11,76.07 118.03,69.6 118.03,70.48 118.03,71.37 86.79,75.18 86.79,76.07 97.71,69.6 97.71,70.48 97.71,71.37 66.47,75.18 66.47,76.07 77.39,69.6 77.39,70.48 77.39,71.37 46.15,75.18 46.15,76.07 57.07,69.6 57.07,70.48 57.07,71.37 25.83,75.18 25.83,76.07 36.75,69.6 36.75,70.48 36.75,71.37
  pour Top (isolate 0.406): 105.46,25.78 104.44,27.3 100.25,27.3 100.25,25.02 104.7,25.02
  pour Top (isolate 0.406, no thermals): 111.18,17.27 113.21,17.27 113.21,21.59 111.18,21.59
  pour Top (isolate 0.406): 85.14,25.78 84.12,27.3 79.93,27.3 79.93,25.02 84.38,25.02
  pour Top (isolate 0.406, no thermals): 90.86,17.27 92.89,17.27 92.89,21.59 90.86,21.59
  pour Top (isolate 0.406): 64.82,25.78 63.8,27.3 59.61,27.3 59.61,25.02 64.06,25.02
  pour Top (isolate 0.406, no thermals): 70.54,17.27 72.57,17.27 72.57,21.59 70.54,21.59
  pour Top (isolate 0.406): 44.5,25.78 43.48,27.3 39.29,27.3 39.29,25.02 43.74,25.02
  pour Top (isolate 0.406, no thermals): 50.22,17.27 52.25,17.27 52.25,21.59 50.22,21.59
  pour Top (isolate 0.406): 24.18,25.78 23.16,27.3 18.97,27.3 18.97,25.02 23.42,25.02
  pour Top (isolate 0.406, no thermals): 29.9,17.27 31.93,17.27 31.93,21.59 29.9,21.59
  pour Top (isolate 0.406): 113.08,70.74 114.1,69.22 118.29,69.22 118.29,71.5 113.84,71.5
  pour Top (isolate 0.406, no thermals): 107.37,79.25 105.33,79.25 105.33,74.93 107.37,74.93
  pour Top (isolate 0.406): 92.76,70.74 93.78,69.22 97.97,69.22 97.97,71.5 93.52,71.5
  pour Top (isolate 0.406, no thermals): 87.05,79.25 85.01,79.25 85.01,74.93 87.05,74.93
  pour Top (isolate 0.406): 72.44,70.74 73.46,69.22 77.65,69.22 77.65,71.5 73.2,71.5
  pour Top (isolate 0.406, no thermals): 66.73,79.25 64.69,79.25 64.69,74.93 66.73,74.93
  pour Top (isolate 0.406): 52.12,70.74 53.14,69.22 57.33,69.22 57.33,71.5 52.88,71.5
  pour Top (isolate 0.406, no thermals): 46.41,79.25 44.37,79.25 44.37,74.93 46.41,74.93
  pour Top (isolate 0.406): 31.8,70.74 32.82,69.22 37.01,69.22 37.01,71.5 32.56,71.5
  pour Top (isolate 0.406, no thermals): 26.09,79.25 24.05,79.25 24.05,74.93 26.09,74.93
  pour Route14 (isolate 0.254, rank 6): 12.75,6.35 149.91,6.35 149.91,27.94 160.07,27.94 160.07,-2.54 12.75,-2.54
  pour Route14 (isolate 0.406): 39.17,27.56 40.31,27.56 40.44,27.56 40.44,24.51 40.44,24.13 38.91,22.61 38.91,5.21 36.63,5.21 36.63,22.1 38.66,24.13 38.66,27.56
  pour Route14 (isolate 0.406): 18.85,27.56 19.99,27.56 20.12,27.56 20.12,24.51 20.12,24.13 18.59,22.61 18.59,5.21 16.31,5.21 16.31,22.1 18.34,24.13 18.34,27.56
  pour Route14 (isolate 0.406): 59.49,27.56 60.63,27.56 60.76,27.56 60.76,24.51 60.76,24.13 59.23,22.61 59.23,5.21 56.95,5.21 56.95,22.1 58.98,24.13 58.98,27.56
  pour Route14 (isolate 0.406): 79.81,27.56 80.95,27.56 81.08,27.56 81.08,24.51 81.08,24.13 79.55,22.61 79.55,5.21 77.27,5.21 77.27,22.1 79.3,24.13 79.3,27.56
  pour Route14 (isolate 0.406): 100.13,27.56 101.27,27.56 101.4,27.56 101.4,24.51 101.4,24.13 99.87,22.61 99.87,5.21 97.59,5.21 97.59,22.1 99.62,24.13 99.62,27.56
  pour Route14 (isolate 0.406): 112.19,21.72 112.19,20.07 110.92,20.07 110.41,19.56 109.91,19.05 109.91,5.46 108.38,5.46 108.38,20.32 109.78,21.72
  pour Route14 (isolate 0.406): 91.87,21.72 91.87,20.07 90.6,20.07 90.09,19.56 89.59,19.05 89.59,5.46 88.06,5.46 88.06,20.32 89.46,21.72
  pour Route14 (isolate 0.406): 71.55,21.72 71.55,20.07 70.28,20.07 69.77,19.56 69.27,19.05 69.27,5.46 67.74,5.46 67.74,20.32 69.14,21.72
  pour Route14 (isolate 0.406): 51.23,21.72 51.23,20.07 49.96,20.07 49.45,19.56 48.95,19.05 48.95,5.46 47.42,5.46 47.42,20.32 48.82,21.72
  pour Route14 (isolate 0.406): 30.91,21.72 30.91,20.07 29.64,20.07 29.13,19.56 28.63,19.05 28.63,5.46 27.1,5.46 27.1,20.32 28.5,21.72
  pour Route14 (isolate 0.254, rank 6): 19.1,101.6 132.13,101.6 132.13,46.99 135.94,43.18 154.99,43.18 154.99,29.21 156.26,27.94 159.56,27.94 159.56,19.94 150.29,19.94 124.51,45.72 124.51,93.98 19.1,93.98
  pour Route14 (isolate 0.406): 37.64,68.96 35.86,68.96 35.86,72.39 37.39,73.91 37.39,95.12 39.67,95.12 39.67,74.42 37.64,72.39
  pour Route14 (isolate 0.406): 57.96,68.96 56.18,68.96 56.18,72.39 57.71,73.91 57.71,95.12 59.99,95.12 59.99,74.42 57.96,72.39
  pour Route14 (isolate 0.406): 78.28,68.96 76.5,68.96 76.5,72.39 78.03,73.91 78.03,95.12 80.31,95.12 80.31,74.42 78.28,72.39
  pour Route14 (isolate 0.406): 98.6,68.96 96.82,68.96 96.82,72.39 98.35,73.91 98.35,95.12 100.63,95.12 100.63,74.42 98.6,72.39
  pour Route14 (isolate 0.406): 118.92,68.96 117.14,68.96 117.14,72.39 118.67,73.91 118.67,95.12 120.95,95.12 120.95,74.42 118.92,72.39
-RAIL  (7 unrouted)
-VPWR  (via drill 0.38)
  Top 0.406: U4.18 114.86,27.03 C28.2 | U6.18 94.54,27.03 C40.2 | U8.18 74.22,27.03 C52.2 | U10.18 53.9,27.03 C64.2 | U12.18 33.58,27.03 C76.2 | U14.18 103.68,69.49 C88.2 | U16.18 83.36,69.49 C100.2 | U18.18 63.04,69.49 C112.2 | U20.18 42.72,69.49 C124.2 | U22.18 22.4,69.49 C136.2
  other vias: 120.07,25.65 120.95,25.65 100.63,13.72 100.63,12.83 100.63,11.94 98.35,25.81 99.24,25.81 80.31,13.72 80.31,12.83 80.31,11.94 77.77,25.91 78.79,25.91 59.99,13.72 59.99,12.83 59.99,11.94 57.45,25.78 58.34,25.78 39.67,13.72 39.67,12.83 39.67,11.94 37.13,25.91 38.02,25.91 19.35,13.72 19.35,12.83 19.35,11.94 100,70.74 98.98,70.74 117.91,82.8 117.91,83.69 117.91,84.58 79.68,70.87 78.66,70.87 97.59,82.8 97.59,83.69 97.59,84.58 59.36,70.87 58.34,70.87 77.27,82.8 77.27,83.69 77.27,84.58 39.04,70.87 38.02,70.87 56.95,82.8 56.95,83.69 56.95,84.58 18.72,70.99 17.7,70.99 36.63,82.8 36.63,83.69 36.63,84.58
  pour Top (isolate 0.406): 112.95,27.05 113.72,26.16 118.54,26.16 118.54,27.81 113.72,27.81
  pour Top (isolate 0.406): 106.73,13.97 100.38,13.97 100.38,11.68 108,11.68 108,14.1
  pour Top (isolate 0.406): 116,27.69 121.21,27.69 121.21,25.53 116,25.53
  pour Top (isolate 0.406): 92.63,27.05 93.4,26.16 98.22,26.16 98.22,27.81 93.4,27.81
  pour Top (isolate 0.406): 86.41,13.97 80.06,13.97 80.06,11.68 87.68,11.68 87.68,14.1
  pour Top (isolate 0.406): 95.68,27.69 99.54,27.66 99.54,25.5 95.68,25.53
  pour Top (isolate 0.406): 72.31,27.05 73.08,26.16 77.9,26.16 77.9,27.81 73.08,27.81
  pour Top (isolate 0.406): 66.09,13.97 59.74,13.97 59.74,11.68 67.36,11.68 67.36,14.1
  pour Top (isolate 0.406): 75.36,27.69 78.92,27.69 78.92,25.4 75.36,25.4
  pour Top (isolate 0.406): 51.99,27.05 52.76,26.16 57.58,26.16 57.58,27.81 52.76,27.81
  pour Top (isolate 0.406): 45.77,13.97 39.42,13.97 39.42,11.68 47.04,11.68 47.04,14.1
  pour Top (isolate 0.406): 55.04,27.69 58.6,27.69 58.6,25.53 55.04,25.53
  pour Top (isolate 0.406): 31.67,27.05 32.44,26.16 37.26,26.16 37.26,27.81 32.44,27.81
  pour Top (isolate 0.406): 25.45,13.97 19.1,13.97 19.1,11.68 26.72,11.68 26.72,14.1
  pour Top (isolate 0.406): 34.72,27.69 38.28,27.69 38.28,25.53 34.72,25.53
  pour Top (isolate 0.406): 105.59,69.47 104.83,70.36 100,70.36 100,68.71 104.83,68.71
  pour Top (isolate 0.406): 111.81,82.55 118.16,82.55 118.16,84.84 110.54,84.84 110.54,82.42
  pour Top (isolate 0.406): 102.54,68.83 98.6,68.83 98.6,71.12 102.54,71.12
  pour Top (isolate 0.406): 85.27,69.47 84.51,70.36 79.68,70.36 79.68,68.71 84.51,68.71
  pour Top (isolate 0.406): 91.49,82.55 97.84,82.55 97.84,84.84 90.22,84.84 90.22,82.42
  pour Top (isolate 0.406): 82.35,68.96 78.28,68.96 78.28,71.25 82.22,71.25
  pour Top (isolate 0.406): 64.95,69.47 64.19,70.36 59.36,70.36 59.36,68.71 64.19,68.71
  pour Top (isolate 0.406): 71.17,82.55 77.52,82.55 77.52,84.84 69.9,84.84 69.9,82.42
  pour Top (isolate 0.406): 61.9,68.83 57.96,68.83 57.96,71.37 61.9,71.37
  pour Top (isolate 0.406): 44.63,69.47 43.87,70.36 39.04,70.36 39.04,68.71 43.87,68.71
  pour Top (isolate 0.406): 50.85,82.55 57.2,82.55 57.2,84.84 49.58,84.84 49.58,82.42
  pour Top (isolate 0.406): 41.58,68.83 37.64,68.83 37.64,71.25 41.58,71.25
  pour Top (isolate 0.406): 24.31,69.47 23.55,70.36 18.72,70.36 18.72,68.71 23.55,68.71
  pour Top (isolate 0.406): 30.53,82.55 36.88,82.55 36.88,84.84 29.26,84.84 29.26,82.42
  pour Top (isolate 0.406): 21.26,68.83 17.07,68.83 17.07,71.37 21.26,71.37
  pour Bottom (isolate 0.254, rank 6): 12.75,6.35 149.91,6.35 149.91,27.94 167.69,27.94 167.69,-2.54 12.75,-2.54
  pour Bottom (isolate 0.406): 20.37,13.97 20.37,11.43 18.69,11.43 17.78,10.52 17.78,5.13 17.83,5.08 14.02,5.08 14.02,11.43 16.56,13.97
  pour Bottom (isolate 0.406): 40.69,13.97 40.69,11.43 39.01,11.43 38.1,10.52 38.1,5.13 38.15,5.08 34.34,5.08 34.34,11.43 36.88,13.97
  pour Bottom (isolate 0.406): 61.01,13.97 61.01,11.43 59.33,11.43 58.42,10.52 58.42,5.13 58.47,5.08 54.66,5.08 54.66,11.43 57.2,13.97
  pour Bottom (isolate 0.406): 81.33,13.97 81.33,11.43 79.65,11.43 78.74,10.52 78.74,5.13 78.79,5.08 74.98,5.08 74.98,11.43 77.52,13.97
  pour Bottom (isolate 0.406): 101.65,13.97 101.65,11.43 99.97,11.43 99.06,10.52 99.06,5.13 99.11,5.08 95.3,5.08 95.3,11.43 97.84,13.97
  pour Bottom (isolate 0.254): 97.84,26.01 97.84,12.7 100.38,12.7 100.38,23.67 99.62,24.43 99.62,26.01
  pour Bottom (isolate 0.254): 77.52,26.01 77.52,12.7 80.06,12.7 80.06,23.67 79.3,24.43 79.3,26.01
  pour Bottom (isolate 0.254): 57.2,26.01 57.2,12.7 59.74,12.7 59.74,23.67 58.98,24.43 58.98,26.01
  pour Bottom (isolate 0.254): 36.88,26.01 36.88,12.7 39.42,12.7 39.42,23.67 38.66,24.43 38.66,26.01
  pour Bottom (isolate 0.254): 119.43,26.01 119.43,5.08 121.97,5.08 121.97,23.67 121.21,24.43 121.21,26.01
  pour Bottom (isolate 0.254, rank 6): 19.1,101.6 132.13,101.6 132.13,46.99 135.94,43.18 154.99,43.18 154.99,29.21 156.26,27.94 165.91,27.94 165.91,19.94 150.29,19.94 124.51,45.72 124.51,93.98 19.1,93.98
  pour Bottom (isolate 0.406): 35.99,82.42 35.99,84.96 37.67,84.96 38.58,85.88 38.58,91.26 38.53,95.12 42.34,95.12 42.34,84.96 39.8,82.42
  pour Bottom (isolate 0.406): 56.31,82.42 56.31,84.96 57.99,84.96 58.9,85.88 58.9,91.26 58.85,95.12 62.66,95.12 62.66,84.96 60.12,82.42
  pour Bottom (isolate 0.406): 76.63,82.42 76.63,84.96 78.31,84.96 79.22,85.88 79.22,91.26 79.17,95.12 82.98,95.12 82.98,84.96 80.44,82.42
  pour Bottom (isolate 0.406): 96.95,82.42 96.95,84.96 98.63,84.96 99.54,85.88 99.54,91.26 99.49,95.12 103.3,95.12 103.3,84.96 100.76,82.42
  pour Bottom (isolate 0.406): 117.27,82.42 117.27,84.96 118.95,84.96 119.86,85.88 119.86,91.26 119.81,95.12 123.62,95.12 123.62,84.96 121.08,82.42
  pour Bottom (isolate 0.254): 39.42,70.51 39.42,83.82 36.88,83.82 36.88,72.85 37.64,72.09 37.64,70.51
  pour Bottom (isolate 0.254): 59.74,70.51 59.74,83.82 57.2,83.82 57.2,72.85 57.96,72.09 57.96,70.51
  pour Bottom (isolate 0.254): 80.06,70.51 80.06,83.82 77.52,83.82 77.52,72.85 78.28,72.09 78.28,70.51
  pour Bottom (isolate 0.254): 100.38,70.51 100.38,83.82 97.84,83.82 97.84,72.85 98.6,72.09 98.6,70.51
  pour Bottom (isolate 0.254): 19.1,70.51 19.1,99.06 16.56,99.06 16.56,72.85 17.32,72.09 17.32,70.51
AGND  (58 unrouted)
ANALOG_REF  (via drill 0.6, 0.7)  (1 unrouted)
  Top 0.61: U5.3 103.81,14.86 C29.1 | U7.3 83.49,14.86 C41.1 | U9.3 63.17,14.86 C53.1 | U11.3 42.85,14.86 C65.1 | U13.3 22.53,14.86 C77.1 | U17.3 94.41,81.66 C101.1 | U19.3 74.09,81.66 C113.1 | U21.3 53.77,81.66 C125.1
  Top 0.813: C29.1 98.39,15.28 97.21,14.1 v97.21,4.83 | C41.1 78.19,15.28 76.89,13.97 76.89,4.7 | C53.1 58,15.28 56.57,13.84 v56.57,5.97 | C65.1 37.68,15.28 36.25,13.84 v36.25,5.97 v36.25,4.83 36.37,4.83 | U13.3 16.69,14.86 15.54,13.72 v15.54,6.1 15.54,5.08 | U23.3 33.03,81.66 C137.1 35.14,81.24 v35.23,81.15 | C125.1 55.59,81.24 v55.68,81.15 | C113.1 76.16,81.24 v76.25,81.15 | C101.1 96.48,81.24 v96.57,81.15 | C89.1 114.31,81.66 U15.3 114.35,81.66 114.86,81.15 117.02,81.15 v117.14,81.03
  Route3 0.813: v35.23,81.15 36.75,81.15 38.15,82.55 38.15,95.25 | v55.68,81.15 57.33,81.15 58.72,82.55 58.72,95 58.47,95.25 | v76.25,81.15 77.9,81.15 79.17,82.42 79.17,94.87 78.79,95.25 | v96.57,81.15 98.09,81.15 99.49,82.55 99.49,95 99.24,95.25 | v117.14,81.03 118.41,81.03 119.94,82.55 119.94,95
  other vias: 15.54,4.95 56.57,4.83 76.89,5.97 76.89,4.83 97.21,5.97
  pour Route3 (isolate 0.254): 12.75,-1.27 144.07,-1.27 144.07,22.35 125.78,22.35 125.78,6.35 125.27,6.35 12.75,6.35
  pour Route3 (rank 6): 12.75,6.35 11.48,6.35 7.67,10.16 7.67,90.17 11.48,93.98 123.24,93.98 123.24,99.06 2.59,99.06 2.59,1.27 12.75,1.27
DGND  (via drill 0.4)
  Top 0.254: 150.21,71.42 R7.1 | U40.61 148.42,62 | ISO1.2 138.26,91.29 138.3,91.25 | ISO6.8 137.9,63.72 138.17,64 | ISO2.2 137.89,84.91 138.55,84.25 v138.55,82.75
  Top 0.305: U2.11 144.17,82 v145.3,80.88 | U2.4 143.92,85.5 v144.55,86.12 | U2.18 143.7,78.5 144.42,79.22 | U2.46 149.42,82 | U2.39 148.92,78.5 | U2.25 v144.67,75 | v148.55,76 149.55,75 U2.32 | U3.11 145.17,62 | U3.39 148.42,58.5 | U3.25 v144.8,55 | U3.32 148.42,55 v148.17,54.75 | U3.4 v144.17,65.5 | U3.53 v148.92,65.5 | U3.55 149.67,66.5 | 149.67,66.5 149.42,66.5 | U3.56 150.17,67 149.67,66.5 | U3.18 144.17,58.5 | U2.53 149.42,85.5 v148.92,85 | U3.29 150.67,53.5 v151.3,52.88 | 138.05,47.38 140.4,47.38 C22.2
  Top 0.406: ISO4.2 137.99,72.41 | ISO5.2 138.01,66.16 | ISO5.8 139.15,69.97 138.3,70 | ISO7.8 137.77,57.47 138.55,58.25 | ISO6.2 138.39,59.91 138.55,59.75 | ISO7.2 138.39,53.66 v138.67,53.38 | ISO8.8 137.77,51.22 138.67,52.12 | ISO8.2 138.01,47.41 138.05,47.38 | ISO10.15 138.39,78.66 v138.55,78.5 | U1.17 149.07,92.97 | U1.13 151.8,90.38 v152.42,89.75 | U1.8 145.55,90.38 146.05,90.88 v146.05,91.88 | U1.4 146.02,92.97 v146.05,92.62 | U1.15 149.22,91.67
  Bottom 0.254: U40.26 143.92,73 | U40.24 143.8,72 | U40.60 149.17,62.5
  Bottom 0.305: U2.25 144.42,75 | U40.18 143.67,69 144.17,69.5 v144.17,72.38 | U40.21 143.92,70.5 | U40.39 149.3,73 | U40.44 149.17,70.5 | U40.47 149.17,69 | U40.2 142.3,61 141.92,61.38 141.92,62.12 142.3,62.5 U40.5 | U40.5 144.05,62.5 | U40.5 144.67,62.5 v145.3,61.75 145.8,61.38 148.92,61.38 149.3,61 | U40.10 143.8,65 | U40.57 149.42,64 | U40.53 149.42,66 | U40.64 149.8,60.5 149.3,61 | U40.63 149.3,61 | U40.8 143.67,64 144.3,64.62 144.3,65.38 v144.17,65.5 143.67,66 U40.12 | 138.55,63.62 138.55,66.03 C16.2
  Bottom 0.406: 149.3,73 v149.05,73 | ISO11.8 138.52,59.28 v138.67,58.62 | ISO4.8 138.27,76.22 | ISO10.9 139.15,82.47 v139.3,82.75 | ISO10.15 138.39,78.66 v138.55,78.5 | ISO11.2 138.01,63.09 138.55,63.62
  Bottom 0.813: C25.2 149.02,86.85 148.92,86.75 v148.92,85
  other vias: 144.55,80.88 145.3,86.12 148.17,79.62 148.92,79.62 145.42,75 144.17,73.12 148.92,85.75 144.8,62.25 147.92,59.25 144.05,58.5 144.8,58.5 148.67,59.25 144.05,55 148.92,54.75 144.92,65.5 148.17,65.5 148.92,62.75 147.3,70.12 147.3,69.38 138.55,89 139.3,89 138.17,95.88 138.67,95.38 138.67,64.88 138.67,64.12 138.42,70.75 138.92,70.25 139.17,59.12 139.55,53.38 138.55,76.5 148.17,62.75 148.55,92.12 151.67,89.75 148.17,73 147.8,92.12 140.8,47.5 141.55,47.5
  pour Route2 (isolate 0.254): 136.05,99.5 136.05,44.12 165.55,44.12 165.55,99.5
  pour Top (isolate 0.254, no thermals): 142.67,82 142.67,81.88 143.67,81.88 144.17,81.38 144.17,79.12 143.67,78.62 142.67,78.62 142.67,78.5 143.8,78.5 145.67,80.38 145.67,81 144.67,82
  pour Bottom (isolate 0.254, no thermals): 144.17,81.38 144.17,80.25 144.55,79.88 145.3,79.88 145.67,80.25 145.67,81.38 145.3,81.75 144.55,81.75
  pour Top (isolate 0.254, no thermals): 143.67,85.5 143.92,85.5 144.17,85.75 145.42,85.75 145.67,86 145.67,86.25 145.42,86.5 144.42,86.5 144.17,86.25 144.17,86
  pour Top (isolate 0.254, no thermals): 150.3,85.38 149.42,85.38 149.3,85.25 149.3,85 149.05,84.75 148.8,84.75 148.67,84.88 148.67,86.5 149.17,87 150.42,87 150.42,86.5 149.55,86.5 149.3,86.25 149.3,85.75 149.42,85.62 150.3,85.62 150.55,85.5
  pour Bottom (isolate 0.254, rank 2, no thermals): 147.8,79.75 149.42,81.38 149.42,81.88 150.17,81.88 150.17,80.75 149.3,79.88 149.3,79.25 150.42,78.12 150.42,75.5 149.92,75.5 149.92,77 148.92,78 148.92,78.62 148.3,79.25 148.05,79.25 147.8,79.5
  pour Top (isolate 0.254, no thermals): 149.67,82 149.3,81.62 149.3,78.88 149.67,78.5 148.8,78.5 147.92,79.38 147.92,80.62 149.3,82
  pour Top (isolate 0.254, no thermals): 141.67,70.75 142.92,70.75 143.42,70.25 143.42,68.88 144.17,68.88 144.17,71.88 144.55,72.25 144.55,73.25 144.3,73.5 143.67,73.5 143.3,73.88 143.3,74 142.67,74 142.67,72.5 141.67,71.5
  pour Bottom (isolate 0.254, no thermals): 144.3,75 144.55,74.75 145.55,74.75 145.67,74.88 145.67,75.12 145.55,75.25 144.55,75.25
  pour Top (isolate 0.254, no thermals): 145.55,74.75 144.55,74.75 144.3,75 144.55,75.25 145.55,75.25 145.67,75.12 145.67,74.88
  pour Bottom (isolate 0.254, no thermals): 143.92,69 143.42,69 143.67,69.25 143.67,70.25 143.42,70.5 143.67,70.75 143.67,71.75 143.42,72 143.67,72.25 143.67,72.75 143.42,73 143.92,73.5 144.3,73.5 144.55,73.25 144.55,69.62
  pour Top (isolate 0.254, no thermals): 147.8,73.12 147.8,72.88 148.05,72.62 149.55,72.62 150.17,72 150.17,70.88 151.05,70.88 151.05,72.12 150.55,72.62 150.55,73.5 149.8,73.5 149.67,73.38 148.05,73.38
  pour Bottom (isolate 0.254, no thermals): 146.92,69.25 146.92,70.25 147.17,70.5 149.67,70.5 149.42,70.25 149.42,69.25 149.67,69 147.17,69
  pour Bottom (isolate 0.254, no thermals): 145.05,62.5 146.17,61.38 145.3,61.38 144.17,62.5
  pour Top (isolate 0.254, no thermals): 145.55,61.88 144.92,62.5 144.67,62.5 144.17,62 144.67,62 145.17,61.5 145.42,61.5 145.55,61.62
  pour Top (isolate 0.254, no thermals): 143.92,58.25 144.92,58.25 145.05,58.38 145.05,58.62 144.92,58.75 143.92,58.75 143.67,58.5
  pour Top (isolate 0.254, rank 2, no thermals): 147.55,59.12 148.17,58.5 149.55,58.5 148.92,59.12 148.92,59.38 148.67,59.62 147.8,59.62 147.55,59.38
  pour Top (isolate 0.254, no thermals): 143.55,55 143.92,55.38 144.8,55.38 145.05,55.12 145.05,54.88 143.67,53.5 142.8,53.5 142.8,54 143.55,54 143.8,54.25 143.8,54.75
  pour Top (isolate 0.254, no thermals): 147.8,54.88 147.8,54.62 148.05,54.38 149.05,54.38 149.67,55 149.17,55 149.05,55.12 148.05,55.12
  pour Bottom (isolate 0.254, no thermals): 148.05,54.38 149.05,54.38 149.3,54.62 149.3,55.12 149.67,55.5 149.67,56 147.42,56 147.42,55.5 147.8,55.12 147.8,54.62
  pour Bottom (isolate 0.254, rank 2, no thermals): 149.3,58 147.3,58 147.3,59.12 147.8,59.62 148.67,59.62 149.3,59
  pour Bottom (isolate 0.254, no thermals): 143.67,64 142.67,64 142.92,64.12 143.67,64.12 143.8,64.25 143.8,64.75 143.55,65 143.8,65.25 143.8,65.75 143.55,66 144.92,66 145.3,65.62 145.3,65.38 145.05,65.12 144.8,65.12
  pour Top (isolate 0.254, no thermals): 145.3,65.62 145.3,65.38 145.05,65.12 144.05,65.12 143.67,65.5 144.05,65.88 145.05,65.88
  pour Top (isolate 0.254, no thermals): 150.3,67 150.3,66.5 149.67,66.5 149.42,66.25 149.42,65.75 149.67,65.5 149.3,65.12 148.05,65.12 147.8,65.38 147.8,65.62 148.17,66 148.8,66 149.8,67
  pour Bottom (isolate 0.254, no thermals): 147.8,65.62 147.8,65.38 148.05,65.12 148.17,65.12 149.3,64 149.55,64 149.3,64.25 149.3,65.75 149.55,66 148.17,66
  pour Top (isolate 0.254, no thermals): 138.42,91.38 137.67,91.38 138.3,90.75 138.3,89.38 137.55,88.62 139.42,88.62 139.67,88.88 139.67,89.12 139.42,89.38 139.42,90.38
  pour Top (isolate 0.254, no thermals): 137.67,82.38 139.42,82.38 139.67,82.62 139.67,82.88 139.42,83.12 139.42,84 138.42,85 136.67,85 137.05,84.75 138.05,84.75 138.17,84.62 138.17,82.88
  pour Top (isolate 0.254, no thermals): 137.55,76.12 138.17,76.75 138.17,78.5 137.92,78.75 138.3,78.75 138.42,78.88 138.67,78.88 138.92,78.62 138.92,76.38 138.67,76.12
  pour Bottom (isolate 0.254, no thermals): 138.67,91.12 138.67,90.38 138.3,90 138.3,89.38 138.17,89.25 138.17,88.88 138.42,88.62 139.42,88.62 139.67,88.88 139.67,89.12 139.42,89.38 139.42,91.12
  pour Bottom (isolate 0.254, no thermals): 138.17,82.88 137.67,82.38 139.42,82.38 139.67,82.62 139.67,82.88 139.42,83.12 139.42,84.88 138.67,84.88 138.67,84.12 138.17,83.62
  pour Top (isolate 0.254, no thermals): 138.17,72.12 138.17,70.62 137.42,69.88 139.17,69.88 139.67,70.38 139.67,70.88 138.05,72.5 137.8,72.5
  pour Top (isolate 0.254, no thermals): 138.3,96.25 138.05,96.25 136.92,95.12 139.92,95.12 139.92,95.88 138.67,95.88
  pour Top (isolate 0.254, no thermals): 137.55,63.62 138.3,64.38 138.3,65.75 137.8,66.25 138.17,66.25 139.05,65.38 139.05,64 138.67,63.62
  pour Bottom (isolate 0.254, no thermals): 138.3,66.5 138.3,63.38 138.42,63.38 139.05,64 139.05,66.5
  pour Bottom (isolate 0.254, no thermals): 138.17,70.12 138.3,70 138.3,69 139.05,69 139.05,70.12 139.17,70.25 139.17,70.38 138.42,71.12 138.42,72 137.92,72.5 136.92,72.5 136.67,72.38 136.92,72.25 137.92,72.25 138.17,72
  pour Top (isolate 0.254, no thermals): 137.8,60 138.3,59.5 138.3,58.12 137.67,57.5 137.67,57.38 137.92,57.38 139.55,59 139.55,59.25 138.8,60
  pour Bottom (isolate 0.254, no thermals): 137.55,59.38 138.3,58.62 138.3,58.5 138.67,58.12 138.67,56.88 139.42,56.88 139.42,58.88 139.55,59 139.55,59.25 139.3,59.5 139.05,59.5 138.92,59.38
  pour Top (isolate 0.254, no thermals): 137.8,53.75 138.3,53.25 138.3,51.62 139.92,53.25 139.92,53.5 139.67,53.75
  pour Top (isolate 0.254, no thermals): 136.92,47.5 137.17,47.25 140.67,47.25 141.05,46.88 141.05,46.12 141.8,46.12 141.8,47.12 141.92,47.25 141.92,47.62 141.67,47.88 140.67,47.88 140.3,47.5
  pour Bottom (isolate 0.254, no thermals): 138.67,54.75 138.67,53.88 138.3,53.5 138.3,53.25 138.55,53 139.67,53 139.92,53.25 139.92,53.5 139.42,54 139.42,54.75
  pour Bottom (isolate 0.254, no thermals): 138.3,76.88 137.55,76.12 139.05,76.12 139.42,75.75 140.05,75.75 140.05,76.5 139.3,76.5 138.92,76.88
  pour Bottom (isolate 0.254, no thermals): 149.05,63.12 149.67,62.5 150.3,62.5 150.3,62 149.8,62 149.42,62.38 148.05,62.38 147.8,62.62 147.8,62.88 148.05,63.12
  pour Top (isolate 0.254, no thermals): 147.8,62.88 147.8,62.62 148.42,62 149.67,62 149.42,62.25 149.42,62.75 149.05,63.12 148.05,63.12
  pour Top (isolate 0.254, no thermals): 147.42,92.25 147.42,92 147.8,91.62 149.3,91.62 148.92,92 148.92,92.75 149.17,93 148.17,93
  pour Top (isolate 0.254, no thermals): 151.55,89.38 152.55,89.38 152.8,89.62 152.8,89.88 152.3,90.38 150.92,90.38 151.3,90 151.3,89.62
  pour Top (isolate 0.254, no thermals): 145.42,92.88 145.55,93 146.17,93 146.42,92.75 146.42,91.12 145.67,90.38 145.3,90.38 145.67,90.75 145.67,92.62
  pour Bottom (isolate 0.254, no thermals): 137.8,96 137.8,95.75 139.17,94.38 139.17,94.12 139.92,94.12 139.92,94.62 138.3,96.25 138.05,96.25
  pour Bottom (isolate 0.254, no thermals): 145.42,86.5 145.67,86.25 145.67,86 145.42,85.75 142.92,85.75 142.92,86.38 144.3,86.38 144.42,86.5
  pour Bottom (isolate 0.254): 147.8,73.12 147.8,72.88 148.05,72.62 149.17,72.62 149.55,73 149.17,73.38 148.05,73.38
  pour Bottom (isolate 0.254, no thermals): 147.42,92.25 147.67,92.5 148.67,92.5 149.8,91.38 150.17,91.38 150.17,90.88 148.55,90.88 147.42,92
  pour Bottom (isolate 0.254, no thermals): 146.3,94.12 145.55,94.12 145.55,91.75 146.05,91.25 146.05,90.38 146.67,90.38 146.67,92.5 146.3,92.88
DI0
  Top 0.305: U2.54 150.92,86 155.55,90.62 155.55,92 J1.E1
DI1
  Top 0.305: U2.52 151.05,85 156.05,90 157.55,90 J1.D2
DI2
  Top 0.305: U2.51 151.3,84.5 152.55,85.75 152.8,85.75 156.05,89 J1.E3
DI3
  Top 0.305: U2.49 152.92,83.5 154.05,84.62 154.05,86 156.05,88 159.55,88 J1.C3
DI4
  Top 0.305: U2.48 153.3,83 154.8,84.5 154.8,85.75 156.05,87 J1.E4
DI5
  Top 0.305: U2.47 153.67,82.5 155.55,84.38 155.55,85.5 156.05,86 159.55,86 J1.C4
DI6
  Top 0.305: U2.45 153.55,81.5 156.05,84 157.55,84 J1.D5
DI7
  Top 0.305: U2.44 154.05,81 156.05,83 J1.E6
DI8
  Top 0.305: U2.43 154.55,80.5 156.05,82 159.55,82 J1.C6
DI9
  Top 0.305: U2.42 155.05,80 156.05,81 J1.E7
DI10
  Top 0.305: U2.41 155.55,79.5 156.05,80 159.55,80 J1.C7
DI11
  Top 0.305: U2.40 152.92,79 153.92,78 157.55,78 J1.D8
DI12
  Top 0.305: U2.38 153.05,78 154.05,77 J1.E9
DI13
  Top 0.305: U2.37 152.55,77.5 154.05,76 159.55,76 J1.C9
DI14
  Top 0.254: U2.36 152.05,77 154.05,75
  Top 0.305: 154.05,75 J1.E10
DI15
  Top 0.305: U2.34 152.05,76 154.05,74 159.55,74 J1.C10
DI16
  Top 0.305: U2.33 151.55,75.5 155.05,72 157.55,72 J1.D11
DI17
  Top 0.305: U2.31 151.55,74.5 155.05,71 J1.E12
DI18
  Top 0.305: U3.54 151.05,66 155.05,70 159.55,70 J1.C12
DI19
  Top 0.305: U3.52 151.05,65 155.05,69 J1.E13
DI20
  Top 0.305: U3.51 151.55,64.5 155.17,68 159.55,68 J1.C13
DI21
  Top 0.305: U3.49 151.55,63.5 154.05,66 157.55,66 J1.D14
DI22
  Top 0.305: U3.48 152.05,63 154.05,65 J1.E15
DI23
  Top 0.305: U3.47 152.55,62.5 154.05,64 159.55,64 J1.C15
DI24
  Top 0.305: U3.45 152.55,61.5 154.05,63 J1.E16
DI25
  Top 0.305: U3.44 153.17,61 154.17,62 159.55,62 J1.C16
DI26
  Top 0.305: U3.43 153.8,60.5 154.3,60 157.55,60 J1.D17
DI27
  Top 0.305: U3.42 153.42,60 154.42,59 J1.E18
DI28
  Top 0.305: U3.41 152.92,59.5 154.42,58 159.55,58 J1.C18
DI29
  Top 0.305: U3.40 152.42,59 154.42,57 J1.E19
DI30
  Top 0.305: U3.38 152.42,58 154.42,56 159.55,56 J1.C19
DI31
  Top 0.305: U3.37 151.92,57.5 155.42,54 157.55,54 J1.D20
DI32
  Top 0.305: U3.36 151.42,57 155.42,53 J1.E21
DI33
  Top 0.305: U3.34 151.42,56 155.42,52 159.55,52 J1.C21
DI34
  Top 0.305: U3.33 150.92,55.5 155.42,51 J1.E22
DI35
  Top 0.305: U3.31 150.92,54.5 155.42,50 159.55,50 J1.C22
DICS  (via drill 0.5, 0.6)
  Top 0.305: v146.42,74.12 146.3,74.25 146.3,86.38 145.05,87.62 142.92,87.62 141.42,89.12 141.42,91.38 v140.77,92.03 139.61,93.19 ISO1.5
  Bottom 0.305: v146.42,74.12 146.42,67.75 146.8,67.38 146.8,64.75 146.67,64.62 146.67,63 147.8,61.88 149.17,61.88 149.55,61.5 U40.62 151.05,61.5 152.3,60.25 152.3,55.62 155.92,52 163.55,52 J1.A21
  Bottom 0.813: R2.2 140.15,92.65 v140.77,92.03
DO0
  Bottom 0.305: U40.37 150.92,74 151.55,74.62 151.55,81.5 156.05,86 163.55,86 J1.A4
DO1
  Bottom 0.305: U40.38 151.3,73.5 152.17,74.38 152.17,80.12 156.05,84 161.55,84 J1.B5
DO2
  Bottom 0.305: U40.40 151.17,72.5 152.8,74.12 152.8,78.75 156.05,82 163.55,82 J1.A6
DO3
  Bottom 0.305: U40.42 151.05,71.5 153.42,73.88 153.42,77.38 156.05,80 163.55,80 J1.A7
DO4
  Bottom 0.305: U40.43 151.42,71 154.05,73.62 154.05,76 156.05,78 161.55,78 J1.B8
DO5
  Bottom 0.305: U40.45 151.3,70 154.67,73.38 154.67,74.62 156.05,76 163.55,76 J1.A9
DO6
  Bottom 0.305: U40.46 151.17,69.5 151.3,69.38 153.42,69.38 156.05,72 161.55,72 J1.B11
DO7
  Bottom 0.305: U40.48 151.17,68.5 151.3,68.62 154.55,68.62 155.92,70 163.55,70 J1.A12
DOCLKI
  Top 0.305: U1.16 152.5,92.33 154.17,94 159.55,94 J1.C1
DOCLKIB
  Top 0.305: ISO1.7 140.49,94.46 R3.2 142.1,94.92 U1.1
DOCLKO  (via drill 0.6)
  Top 0.305: v151.67,91.5 151.17,91 150.12,91 U1.14
  Bottom 0.305: v151.67,91.5 152.17,92 161.55,92 J1.B2
DOCLKOB  (via drill 0.6)
  Top 0.305: U1.9 v143.02,89.72
  Bottom 0.305: ISO10.11 139.13,81.2 140.42,82.5 140.42,87.38 142.77,89.72 v143.02,89.72
DOCS  (via drill 0.6)
  Top 0.305: ISO1.6 140.1,93.83 142.17,91.75 142.17,89.38 142.67,88.88 143.42,88.88 143.62,89.08 U1.10 145.1,89.08 v146.3,87.88 146.3,89.38 146.92,90 146.92,93 148.85,94.92 U1.20
  Bottom 0.305: U40.31 144.05,75.5 144.55,76 145.67,76 146.3,76.62 v146.3,87.88 149.3,87.88 149.42,88 163.55,88 J1.A3
  Bottom 0.813: R1.2 146.42,89 146.3,88.88 v146.3,87.88
DPWR  (via drill 0.38, 0.6)
  Top 0.305: U4.6 105.51,25.07 104.95,24.51 | 104.95,24.51 104.44,24.51 104.06,24.13 104.06,21.93 C26.2 | U4.7 105.03,24.43 104.95,24.51 | U4.9 105.59,23.11 105.08,22.61 | U6.6 85.19,25.07 84.63,24.51 | 84.63,24.51 84.12,24.51 83.74,24.13 83.74,21.93 C38.2 | U6.7 84.71,24.43 84.63,24.51 | U6.9 85.27,23.11 84.76,22.61 | U8.6 64.87,25.07 64.31,24.51 | 64.31,24.51 63.8,24.51 63.42,24.13 63.42,21.93 C50.2 | U8.7 64.39,24.43 64.31,24.51 | U8.9 64.95,23.11 64.44,22.61 | U10.6 44.55,25.07 43.99,24.51 | 43.99,24.51 43.48,24.51 43.1,24.13 43.1,21.93 C62.2 | U10.7 44.07,24.43 43.99,24.51 | U10.9 44.63,23.11 44.12,22.61 | U12.6 24.23,25.07 23.67,24.51 | 23.67,24.51 23.16,24.51 22.78,24.13 22.78,21.93 C74.2 | U12.7 23.75,24.43 23.67,24.51 | U12.9 24.31,23.11 23.8,22.61 | U14.6 113.03,71.45 113.59,72.01 | 113.59,72.01 114.1,72.01 114.48,72.39 114.48,74.59 C86.2 | U14.7 113.51,72.08 113.59,72.01 | U14.9 112.95,73.41 113.46,73.91 | U16.6 92.71,71.45 93.27,72.01 | 93.27,72.01 93.78,72.01 94.16,72.39 94.16,74.59 C98.2 | U16.7 93.19,72.08 93.27,72.01 | U16.9 92.63,73.41 93.14,73.91 | U18.6 72.39,71.45 72.95,72.01 | 72.95,72.01 73.46,72.01 73.84,72.39 73.84,74.59 C110.2 | U18.7 72.87,72.08 72.95,72.01 | U18.9 72.31,73.41 72.82,73.91 | U20.6 52.07,71.45 52.63,72.01 | 52.63,72.01 53.14,72.01 53.52,72.39 53.52,74.59 C122.2 | U20.7 52.55,72.08 52.63,72.01 | U20.9 51.99,73.41 52.5,73.91 | U22.6 31.75,71.45 32.31,72.01 | 32.31,72.01 32.82,72.01 33.2,72.39 33.2,74.59 C134.2 | U22.7 32.23,72.08 32.31,72.01 | U22.9 31.67,73.41 32.18,73.91
  other vias: 118.16,36.83 116.89,35.56 116.89,38.1 118.16,39.37 119.43,38.1 119.43,35.56 24.69,20.7 25.7,20.7 45.01,20.7 46.02,20.7 66.34,20.7 65.46,20.7 86.66,20.7 85.78,20.7 107.11,20.7 105.97,20.7 30.28,75.56 31.29,75.56 51.61,75.56 50.6,75.56 71.93,75.69 70.92,75.69 92.13,75.69 91.11,75.69 112.57,75.69 111.56,75.69
  pour Top (isolate 0.406): 107.37,22.86 103.94,22.86 103.94,20.45 107.37,20.45
  pour Top (isolate 0.406): 87.05,22.86 83.62,22.86 83.62,20.57 87.05,20.57
  pour Top (isolate 0.406): 66.73,22.86 63.3,22.86 63.3,20.45 66.73,20.45
  pour Top (isolate 0.406): 46.41,22.86 42.98,22.86 42.98,20.45 46.41,20.45
  pour Top (isolate 0.406): 26.09,22.86 22.66,22.86 22.66,20.45 26.09,20.45
  pour Top (isolate 0.406): 111.18,73.66 114.6,73.66 114.6,75.95 111.18,75.95
  pour Top (isolate 0.406): 90.86,73.66 94.28,73.66 94.28,75.95 90.86,75.95
  pour Top (isolate 0.406): 70.54,73.66 73.96,73.66 73.96,75.95 70.54,75.95